# Altium project SR.PrjPcb (part 1 of 2)
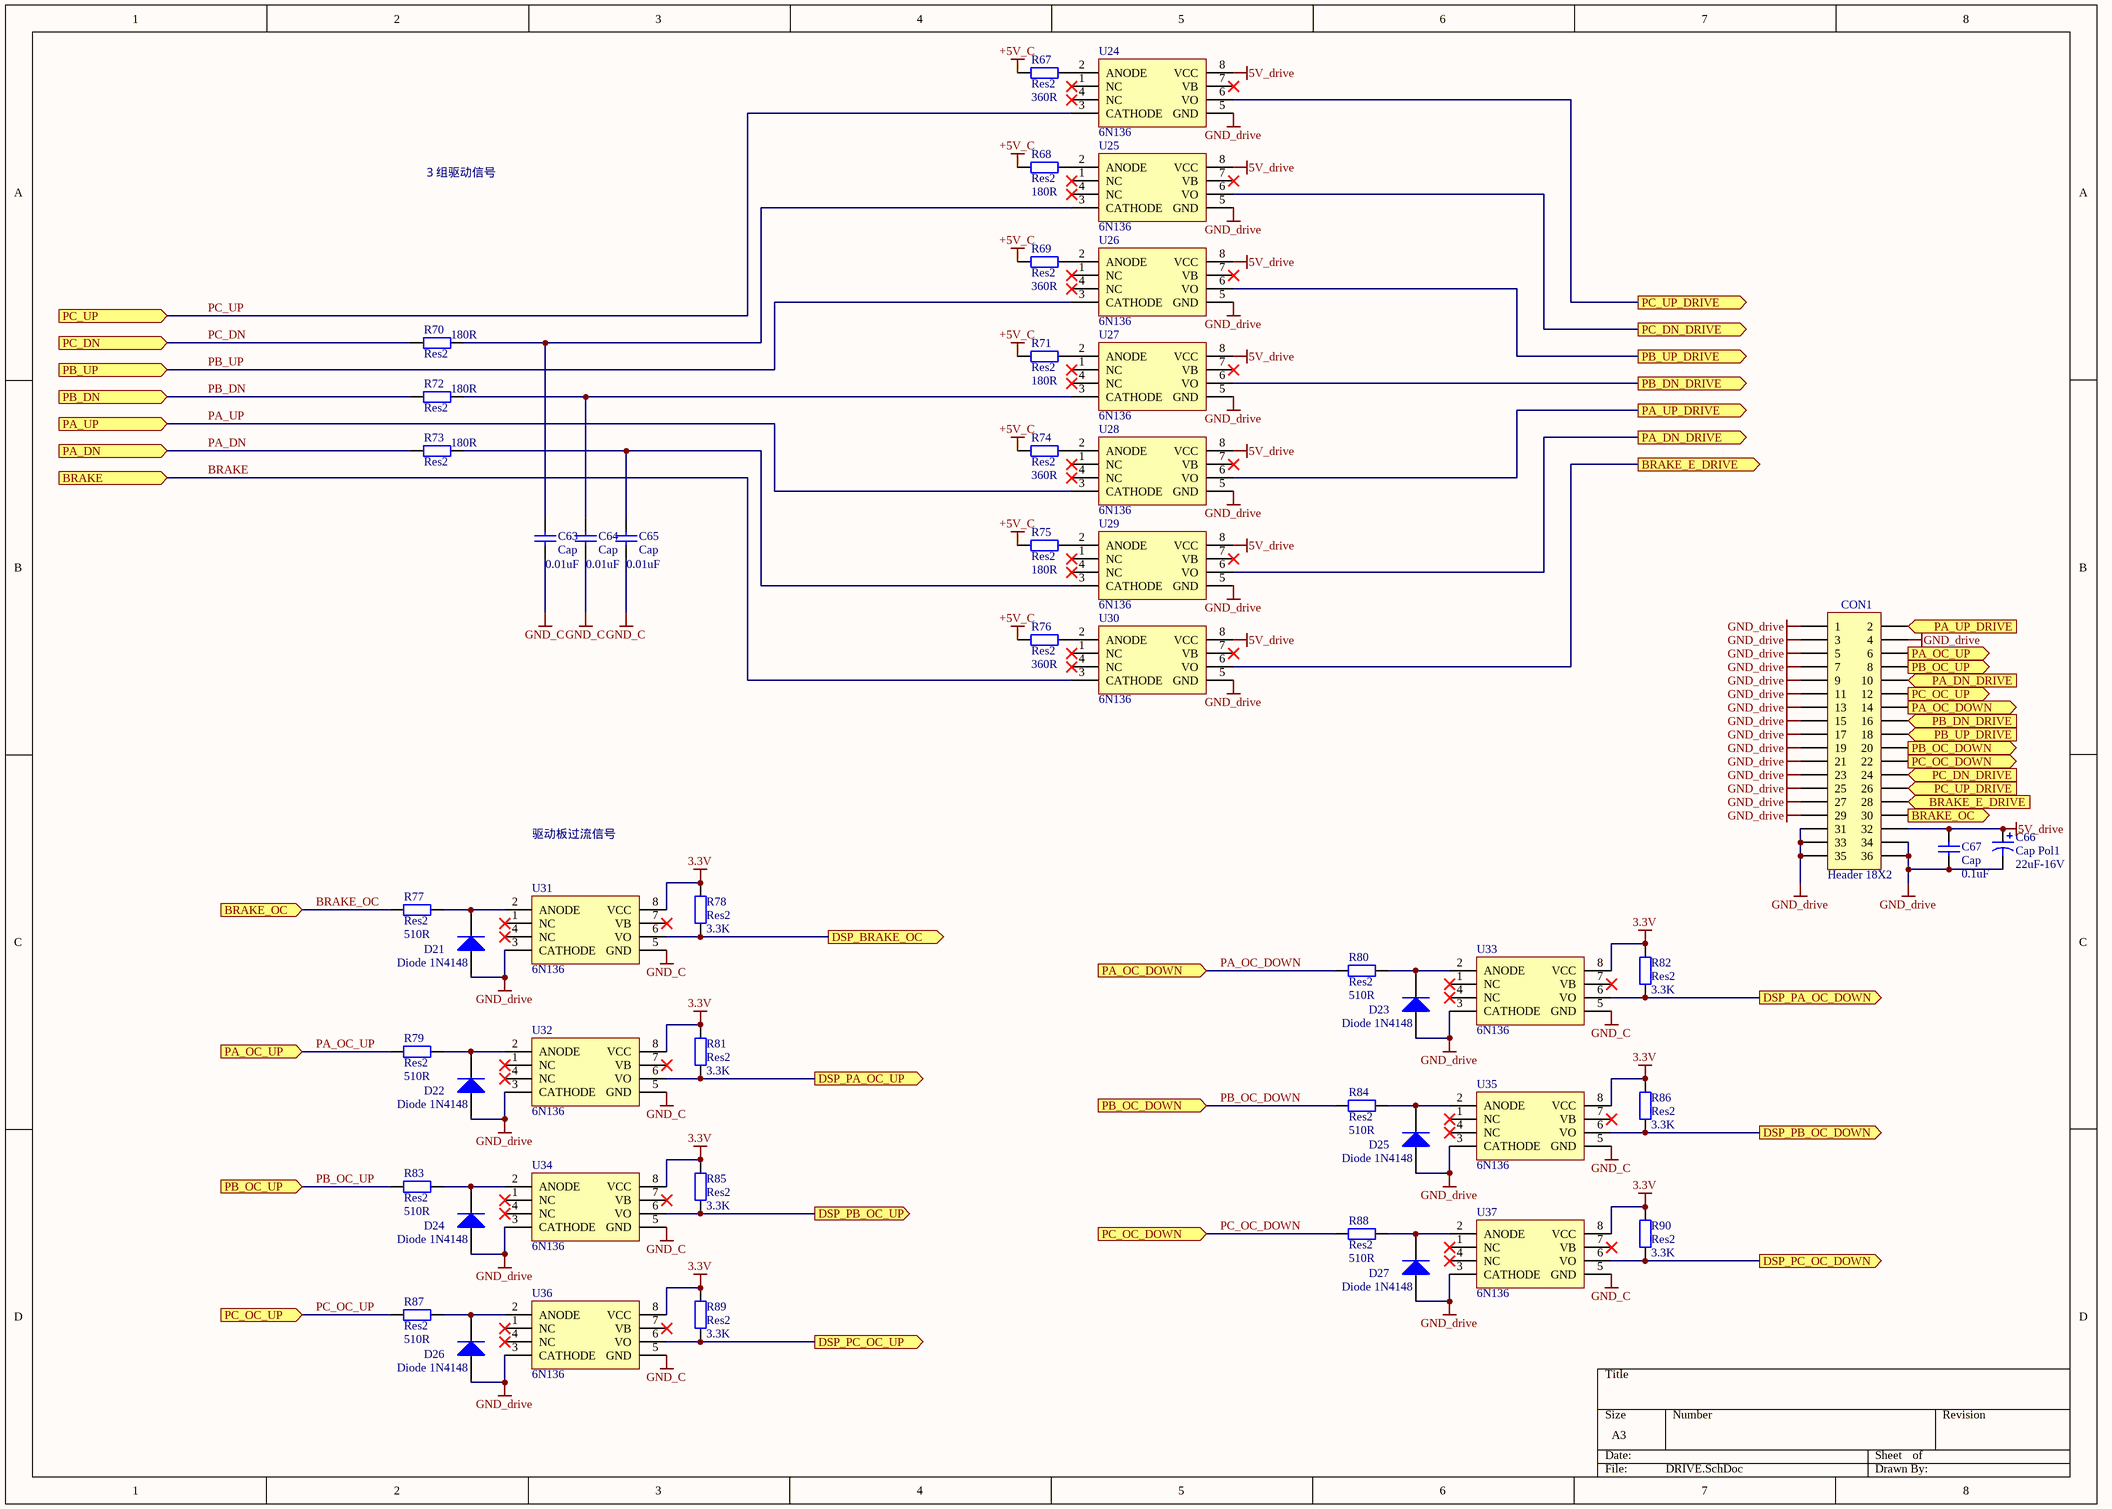
[diagram p0: DRIVE.SchDoc]
6 sheets, 393 parts. Net scope: global (net labels, ports and power ports of the same name join across sheets).
Board file: PCB2.PcbDoc
Sheets:
  DRIVE.SchDoc
  AIAO.SchDoc
  DIDO.SchDoc
  PERIPHERAL.SchDoc
  POWER.SchDoc
  dsp.SchDoc

## Sheet DRIVE.SchDoc
size A3

### Parts
C63  Cap  value 0.01uF  [1206]
C64  Cap  value 0.01uF  [1206]
C65  Cap  value 0.01uF  [1206]
C66  Cap Pol1  value 22uF-16V  [7343]
C67  Cap  value 0.1uF  [1206]
CON1  Header 18X2  [HDR2X18]
D21  Diode 1N4148  [SOD-80/MLL34]
D22  Diode 1N4148  [SOD-80/MLL34]
D23  Diode 1N4148  [SOD-80/MLL34]
D24  Diode 1N4148  [SOD-80/MLL34]
D25  Diode 1N4148  [SOD-80/MLL34]
D26  Diode 1N4148  [SOD-80/MLL34]
D27  Diode 1N4148  [SOD-80/MLL34]
R67  Res2  value 360R  [1206]
R68  Res2  value 180R  [1206]
R69  Res2  value 360R  [1206]
R70  Res2  value 180R  [1206]
R71  Res2  value 180R  [1206]
R72  Res2  value 180R  [1206]
R73  Res2  value 180R  [1206]
R74  Res2  value 360R  [1206]
R75  Res2  value 180R  [1206]
R76  Res2  value 360R  [1206]
R77  Res2  value 510R  [1206]
R78  Res2  value 3.3K  [1206]
R79  Res2  value 510R  [1206]
R80  Res2  value 510R  [1206]
R81  Res2  value 3.3K  [1206]
R82  Res2  value 3.3K  [1206]
R83  Res2  value 510R  [1206]
R84  Res2  value 510R  [1206]
R85  Res2  value 3.3K  [1206]
R86  Res2  value 3.3K  [1206]
R87  Res2  value 510R  [1206]
R88  Res2  value 510R  [1206]
R89  Res2  value 3.3K  [1206]
R90  Res2  value 3.3K  [1206]
U24  6N136  [DIP-8N]
U25  6N136  [DIP-8N]
U26  6N136  [DIP-8N]
U27  6N136  [DIP-8N]
U28  6N136  [DIP-8N]
U29  6N136  [DIP-8N]
U30  6N136  [DIP-8N]
U31  6N136  [DIP-8N]
U32  6N136  [DIP-8N]
U33  6N136  [DIP-8N]
U34  6N136  [DIP-8N]
U35  6N136  [DIP-8N]
U36  6N136  [DIP-8N]
U37  6N136  [DIP-8N]

### Ports
BRAKE (in), BRAKE_E_DRIVE (in), BRAKE_E_DRIVE (out), BRAKE_OC (in), BRAKE_OC (out), DSP_BRAKE_OC (out), DSP_PA_OC_DOWN (out), DSP_PA_OC_UP (out), DSP_PB_OC_DOWN (out), DSP_PB_OC_UP (out), DSP_PC_OC_DOWN (out), DSP_PC_OC_UP (out), PA_DN (in), PA_DN_DRIVE (in), PA_DN_DRIVE (out), PA_OC_DOWN (in), PA_OC_DOWN (out), PA_OC_UP (in), PA_OC_UP (out), PA_UP (in), PA_UP_DRIVE (in), PA_UP_DRIVE (out), PB_DN (in), PB_DN_DRIVE (in), PB_DN_DRIVE (out), PB_OC_DOWN (in), PB_OC_DOWN (out), PB_OC_UP (in), PB_OC_UP (out), PB_UP (in), PB_UP_DRIVE (in), PB_UP_DRIVE (out), PC_DN (in), PC_DN_DRIVE (in), PC_DN_DRIVE (out), PC_OC_DOWN (in), PC_OC_DOWN (out), PC_OC_UP (in), PC_OC_UP (out), PC_UP (in), PC_UP_DRIVE (in), PC_UP_DRIVE (out)

### Nets
3.3V: R78.2 R81.2 R82.2 R85.2 R86.2 R89.2 R90.2 U31.8(VCC) U32.8(VCC) U33.8(VCC) U34.8(VCC) U35.8(VCC) U36.8(VCC) U37.8(VCC)
5V_drive: C66.1 C67.2 CON1.32 U24.8(VCC) U25.8(VCC) U26.8(VCC) U27.8(VCC) U28.8(VCC) U29.8(VCC) U30.8(VCC)
+5V_C: R67.1 R68.1 R69.1 R71.1 R74.1 R75.1 R76.1
GND_C: C63.1 C64.1 C65.1 U31.5(GND) U32.5(GND) U33.5(GND) U34.5(GND) U35.5(GND) U36.5(GND) U37.5(GND)
GND_drive: C66.2 C67.1 CON1.1 CON1.3 CON1.4 CON1.5 CON1.7 CON1.9 CON1.11 CON1.13 CON1.15 CON1.17 CON1.19 CON1.21 CON1.23 CON1.25 CON1.27 CON1.29 CON1.31 CON1.33 CON1.34 CON1.35 CON1.36 D21.1(A) D22.1(A) D23.1(A) D24.1(A) D25.1(A) D26.1(A) D27.1(A) U24.5(GND) U25.5(GND) U26.5(GND) U27.5(GND) U28.5(GND) U29.5(GND) U30.5(GND) U31.3(CATHODE) U32.3(CATHODE) U33.3(CATHODE) U34.3(CATHODE) U35.3(CATHODE) U36.3(CATHODE) U37.3(CATHODE)
BRAKE: U30.3(CATHODE) ; port BRAKE
BRAKE_OC: CON1.30 R77.2 ; port BRAKE_OC
PA_DN: R73.1 ; port PA_DN
PA_OC_DOWN: CON1.14 R80.2 ; port PA_OC_DOWN
PA_OC_UP: CON1.6 R79.2 ; port PA_OC_UP
PA_UP: U28.3(CATHODE) ; port PA_UP
PB_DN: R72.1 ; port PB_DN
PB_OC_DOWN: CON1.20 R84.2 ; port PB_OC_DOWN
PB_OC_UP: CON1.8 R83.2 ; port PB_OC_UP
PB_UP: U26.3(CATHODE) ; port PB_UP
PC_DN: R70.1 ; port PC_DN
PC_OC_DOWN: CON1.22 R88.2 ; port PC_OC_DOWN
PC_OC_UP: CON1.12 R87.2 ; port PC_OC_UP
PC_UP: U24.3(CATHODE) ; port PC_UP
NetC63_2: C63.2 R70.2 U25.3(CATHODE)
NetC64_2: C64.2 R72.2 U27.3(CATHODE)
NetC65_2: C65.2 R73.2 U29.3(CATHODE)
NetCON1_2: CON1.2 U28.6(VO) ; port PA_UP_DRIVE
NetCON1_10: CON1.10 U29.6(VO) ; port PA_DN_DRIVE
NetCON1_16: CON1.16 U27.6(VO) ; port PB_DN_DRIVE
NetCON1_18: CON1.18 U26.6(VO) ; port PB_UP_DRIVE
NetCON1_24: CON1.24 U25.6(VO) ; port PC_DN_DRIVE
NetCON1_26: CON1.26 U24.6(VO) ; port PC_UP_DRIVE
NetCON1_28: CON1.28 U30.6(VO) ; port BRAKE_E_DRIVE
NetD21_2: D21.2(K) R77.1 U31.2(ANODE)
NetD22_2: D22.2(K) R79.1 U32.2(ANODE)
NetD23_2: D23.2(K) R80.1 U33.2(ANODE)
NetD24_2: D24.2(K) R83.1 U34.2(ANODE)
NetD25_2: D25.2(K) R84.1 U35.2(ANODE)
NetD26_2: D26.2(K) R87.1 U36.2(ANODE)
NetD27_2: D27.2(K) R88.1 U37.2(ANODE)
NetR67_2: R67.2 U24.2(ANODE)
NetR68_2: R68.2 U25.2(ANODE)
NetR69_2: R69.2 U26.2(ANODE)
NetR71_2: R71.2 U27.2(ANODE)
NetR74_2: R74.2 U28.2(ANODE)
NetR75_2: R75.2 U29.2(ANODE)
NetR76_2: R76.2 U30.2(ANODE)
NetR78_1: R78.1 U31.6(VO) ; port DSP_BRAKE_OC
NetR81_1: R81.1 U32.6(VO) ; port DSP_PA_OC_UP
NetR82_1: R82.1 U33.6(VO) ; port DSP_PA_OC_DOWN
NetR85_1: R85.1 U34.6(VO) ; port DSP_PB_OC_UP
NetR86_1: R86.1 U35.6(VO) ; port DSP_PB_OC_DOWN
NetR89_1: R89.1 U36.6(VO) ; port DSP_PC_OC_UP
NetR90_1: R90.1 U37.6(VO) ; port DSP_PC_OC_DOWN

Not connected (* = marked no-connect by the designer): U24 1(NC)* 4(NC)* 7(VB)*; U25 1(NC)* 4(NC)* 7(VB)*; U26 1(NC)* 4(NC)* 7(VB)*; U27 1(NC)* 4(NC)* 7(VB)*; U28 1(NC)* 4(NC)* 7(VB)*; U29 1(NC)* 4(NC)* 7(VB)*; U30 1(NC)* 4(NC)* 7(VB)*; U31 1(NC)* 4(NC)* 7(VB)*; U32 1(NC)* 4(NC)* 7(VB)*; U33 1(NC)* 4(NC)* 7(VB)*; U34 1(NC)* 4(NC)* 7(VB)*; U35 1(NC)* 4(NC)* 7(VB)*; U36 1(NC)* 4(NC)* 7(VB)*; U37 1(NC)* 4(NC)* 7(VB)*

### Notes on the sheet
- ３组驱动信号
- 驱动板过流信号

### Library data of the parts
C63-C65 C67 = Cap: Capacitor; Published: 8-Jun-2000; LatestRevisionDate: 17-Jul-2002; LatestRevisionNote: Re-released for DXP Platform.; PackageReference: RAD-0.3; Publisher: Altium Limited
C66 = Cap Pol1: Polarized Capacitor (Radial); Published: 8-Jun-2000; LatestRevisionDate: 17-Jul-2002; LatestRevisionNote: Re-released for DXP Platform.; PackageReference: RB7.6-15; Publisher: Altium Limited
CON1 = Header 18X2: Header, 18-Pin, Dual row; LatestRevisionDate: 17-Jul-2002; LatestRevisionNote: Re-released for DXP Platform.; Publisher: Altium Limited
D21-D27 = Diode 1N4148: High Conductance Fast Diode; Published: 8-Jun-2000; LatestRevisionDate: 17-Jul-2002; LatestRevisionNote: Re-released for DXP Platform.; DatasheetVersion: 1997; PackageReference: DO-35; Publisher: Altium Limited; Code_JEDEC: DO-204-AH; ComponentLink1Description: Manufacturer Link; ComponentLink1URL: http://www.fairchildsemi.com/; ComponentLink2Description: Datasheet; ComponentLink2URL: http://www.fairchildsemi.com/ds/1N%2F1N4148.pdf
R67-R90 = Res2: Resistor; Published: 8-Jun-2000; LatestRevisionDate: 17-Jul-2002; LatestRevisionNote: Re-released for DXP Platform.; PackageReference: AXIAL-0.4; Publisher: Altium Limited
U24-U37 = 6N136: 光耦

## Sheet AIAO.SchDoc
size A3
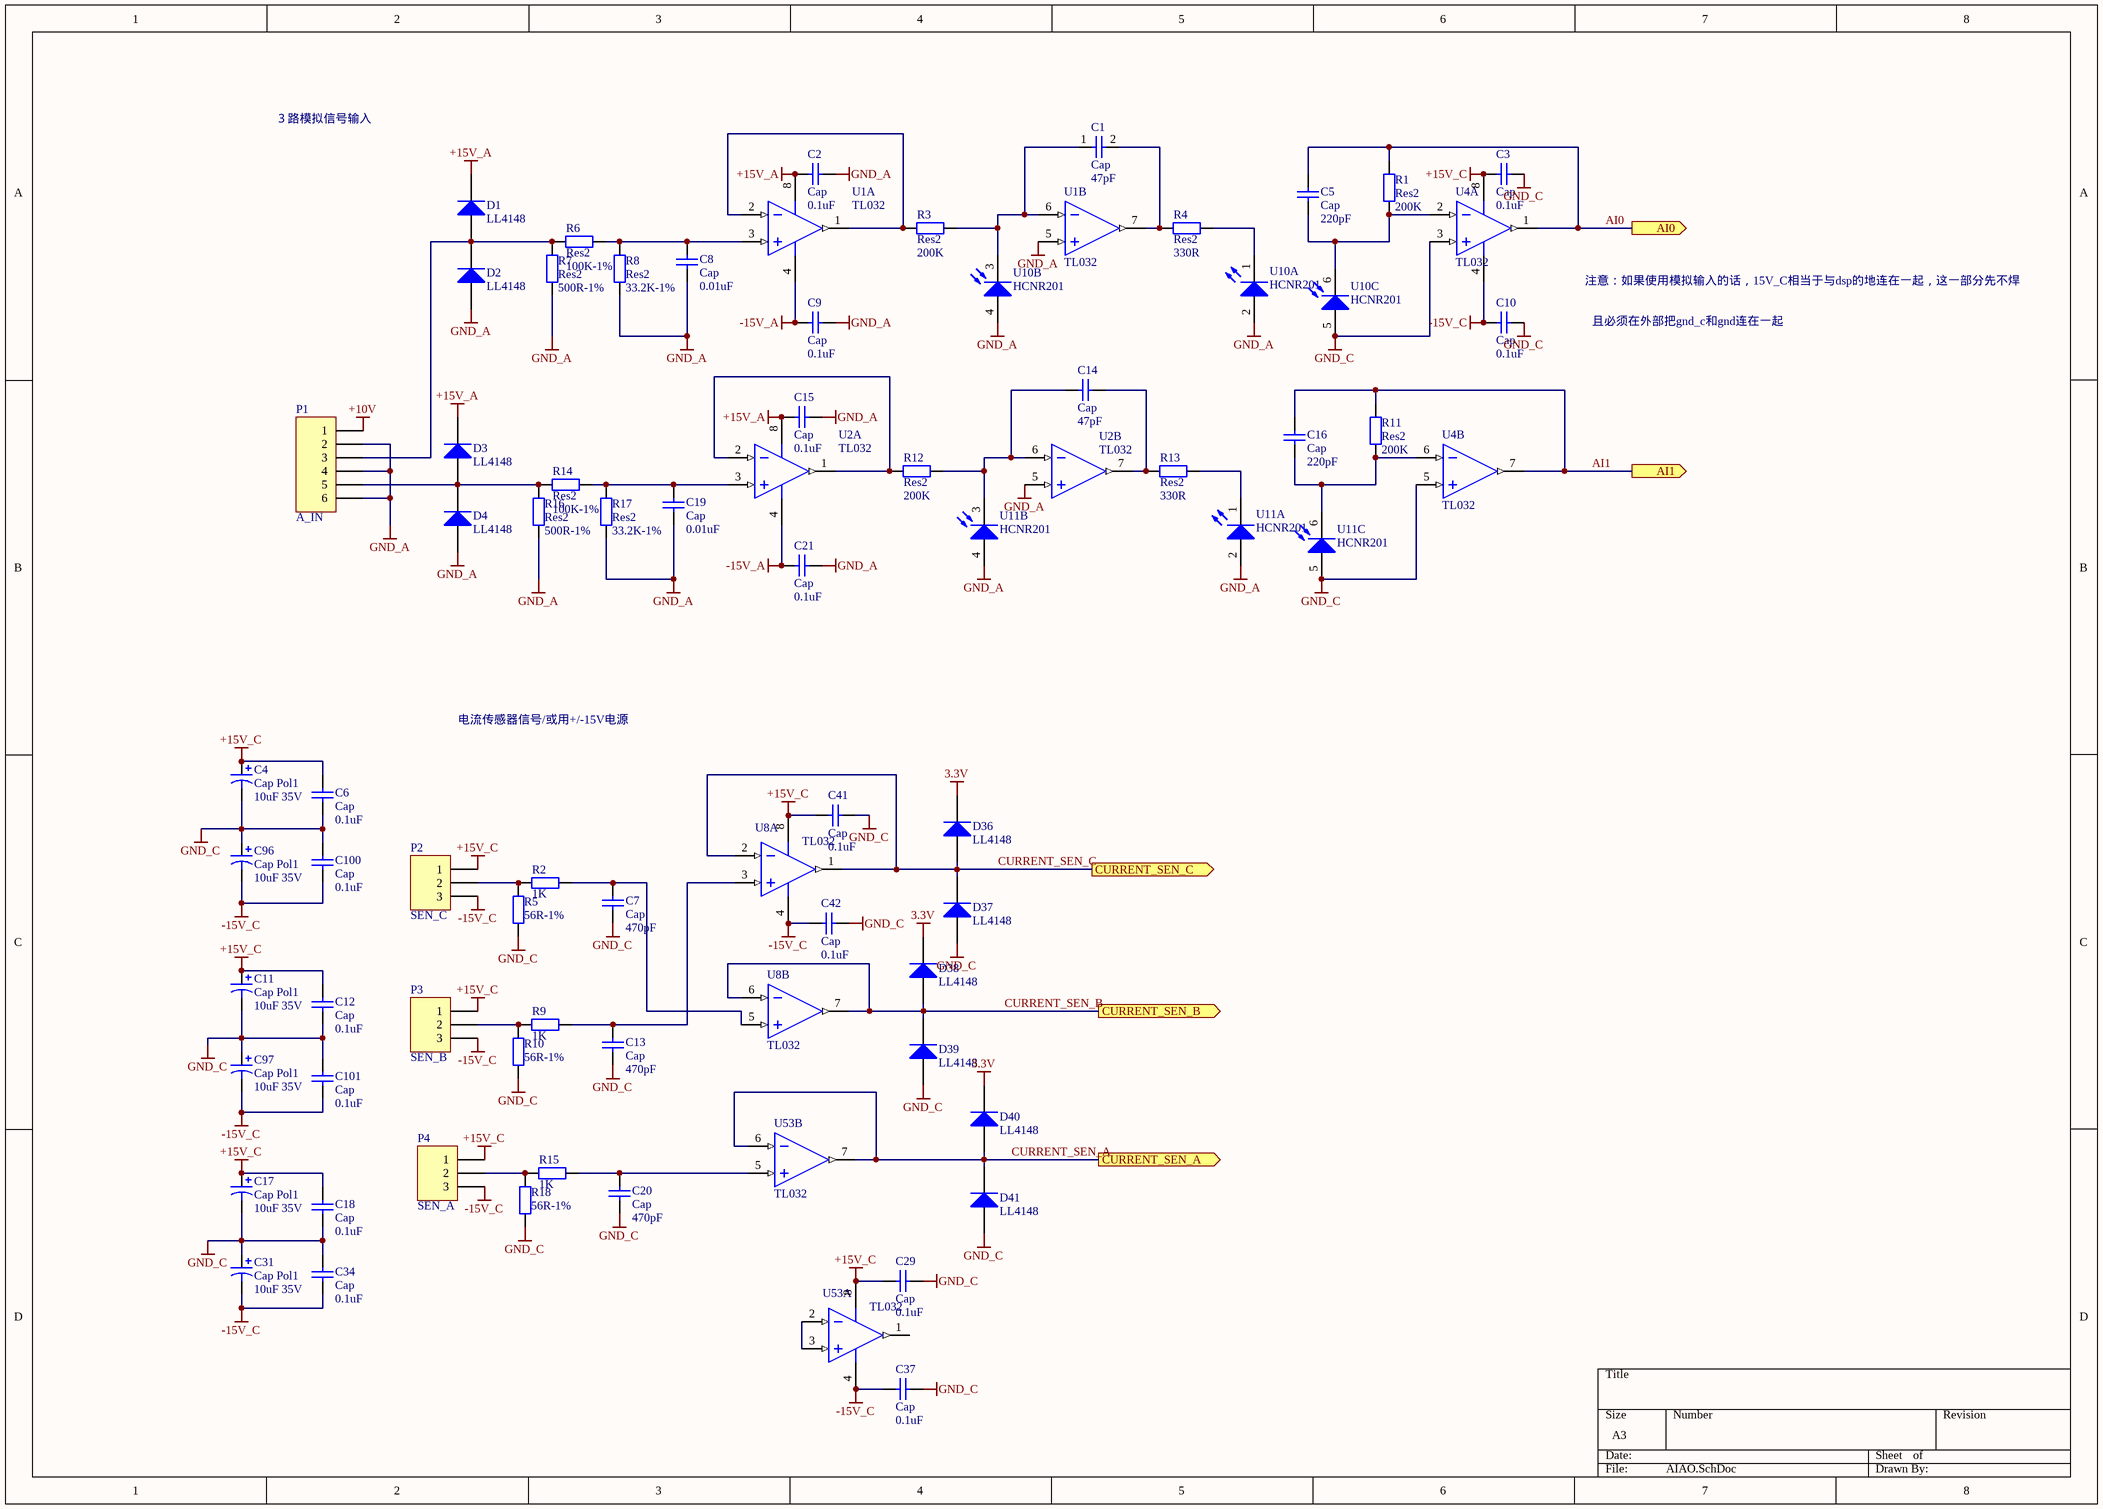
[diagram p1: AIAO.SchDoc]

### Parts
C1  Cap  value 47pF  [1206]
C2  Cap  value 0.1uF  [1206]
C3  Cap  value 0.1uF  [1206]
C4  Cap Pol1  value 10uF 35V  [1206]
C5  Cap  value 220pF  [1206]
C6  Cap  value 0.1uF  [1206]
C7  Cap  value 470pF  [1206]
C8  Cap  value 0.01uF  [1206]
C9  Cap  value 0.1uF  [1206]
C10  Cap  value 0.1uF  [1206]
C11  Cap Pol1  value 10uF 35V  [1206]
C12  Cap  value 0.1uF  [1206]
C13  Cap  value 470pF  [1206]
C14  Cap  value 47pF  [1206]
C15  Cap  value 0.1uF  [1206]
C16  Cap  value 220pF  [1206]
C17  Cap Pol1  value 10uF 35V  [1206]
C18  Cap  value 0.1uF  [1206]
C19  Cap  value 0.01uF  [1206]
C20  Cap  value 470pF  [1206]
C21  Cap  value 0.1uF  [1206]
C29  Cap  value 0.1uF  [1206]
C31  Cap Pol1  value 10uF 35V  [1206]
C34  Cap  value 0.1uF  [1206]
C37  Cap  value 0.1uF  [1206]
C41  Cap  value 0.1uF  [1206]
C42  Cap  value 0.1uF  [1206]
C96  Cap Pol1  value 10uF 35V  [1206]
C97  Cap Pol1  value 10uF 35V  [1206]
C100  Cap  value 0.1uF  [1206]
C101  Cap  value 0.1uF  [1206]
D1  LL4148  [SOD-80/MLL34]
D2  LL4148  [SOD-80/MLL34]
D3  LL4148  [SOD-80/MLL34]
D4  LL4148  [SOD-80/MLL34]
D36  LL4148  [SOD-80/MLL34]
D37  LL4148  [SOD-80/MLL34]
D38  LL4148  [SOD-80/MLL34]
D39  LL4148  [SOD-80/MLL34]
D40  LL4148  [SOD-80/MLL34]
D41  LL4148  [SOD-80/MLL34]
P1  A_IN  [phenox-6]
P2  SEN_C  [PHENOX-3]
P3  SEN_B  [PHENOX-3]
P4  SEN_A  [PHENOX-3]
R1  Res2  value 200K  [1206]
R2  value 1K  [1206]  (hidden comment: Res2)
R3  Res2  value 200K  [1206]
R4  Res2  value 330R  [1206]
R5  value 56R-1%  [1206]  (hidden comment: Res2)
R6  Res2  value 100K-1%  [1206]
R7  Res2  value 500R-1%  [1206]
R8  Res2  value 33.2K-1%  [1206]
R9  value 1K  [1206]  (hidden comment: Res2)
R10  value 56R-1%  [1206]  (hidden comment: Res2)
R11  Res2  value 200K  [1206]
R12  Res2  value 200K  [1206]
R13  Res2  value 330R  [1206]
R14  Res2  value 100K-1%  [1206]
R15  value 1K  [1206]  (hidden comment: Res2)
R16  Res2  value 500R-1%  [1206]
R17  Res2  value 33.2K-1%  [1206]
R18  value 56R-1%  [1206]  (hidden comment: Res2)
U1  TL032  [SO-8]  (parts A,B of 2)
U2  TL032  [SO-8]  (parts A,B of 2)
U4  TL032  [SO-8]  (parts A,B of 2)
U8  TL032  [SO-8]  (parts A,B of 2)
U10  HCNR201  [SOP254P1230X400-8N-2]  (parts A,B,C of 3)
U11  HCNR201  [SOP254P1230X400-8N-2]  (parts A,B,C of 3)
U53  TL032  [SO-8]  (parts A,B of 2)

### Ports
AI0 (out), AI1 (out), CURRENT_SEN_A (out), CURRENT_SEN_B (out), CURRENT_SEN_C (out)

### Nets
3.3V: D36.2(K) D38.2(K) D40.2(K)
+10V: P1.1
+15V_A: C2.1 C15.1 D1.2(K) D3.2(K) U1.8(V+) U2.8(V+)
+15V_C: C3.1 C4.1 C6.2 C11.1 C12.2 C17.1 C18.2 C29.2 C41.2 P2.1 P3.1 P4.1 U4.8(V+) U8.8(V+) U53.8(V+)
-15V_A: C9.1 C21.1 U1.4(V-) U2.4(V-)
-15V_C: C10.1 C31.2 C34.1 C37.2 C42.2 C96.2 C97.2 C100.1 C101.1 P2.3 P3.3 P4.3 U4.4(V-) U8.4(V-) U53.4(V-)
GND_A: C2.2 C8.1 C9.2 C15.2 C19.1 C21.2 D2.1(A) D4.1(A) P1.2 P1.4 P1.6 R7.1 R8.1 R16.1 R17.1 U1.5(IN+) U2.5(IN+) U10.2(A) U10.4(A) U11.2(A) U11.4(A)
GND_C: C3.2 C4.2 C6.1 C7.1 C10.2 C11.2 C12.1 C13.1 C17.2 C18.1 C20.1 C29.1 C31.1 C34.2 C37.1 C41.1 C42.1 C96.1 C97.1 C100.2 C101.2 D37.1(A) D39.1(A) D41.1(A) R5.1 R10.1 R18.1 U4.3(IN+) U4.5(IN+) U10.5(A) U11.5(A)
AI0: C5.2 R1.2 U4.1(OUT) ; port AI0
AI1: C16.2 R11.2 U4.7(OUT) ; port AI1
CURRENT_SEN_A: D40.1(A) D41.2(K) U53.6(IN-) U53.7(OUT) ; port CURRENT_SEN_A
CURRENT_SEN_B: D38.1(A) D39.2(K) U8.6(IN-) U8.7(OUT) ; port CURRENT_SEN_B
CURRENT_SEN_C: D36.1(A) D37.2(K) U8.1(OUT) U8.2(IN-) ; port CURRENT_SEN_C
NetC1_1: C1.1 R3.2 U1.6(IN-) U10.3(K)
NetC1_2: C1.2 R4.1 U1.7(OUT)
NetC5_1: C5.1 R1.1 U4.2(IN-) U10.6(K)
NetC7_2: C7.2 R2.2 U8.5(IN+)
NetC8_2: C8.2 R6.2 R8.2 U1.3(IN+)
NetC13_2: C13.2 R9.2 U8.3(IN+)
NetC14_1: C14.1 R12.2 U2.6(IN-) U11.3(K)
NetC14_2: C14.2 R13.1 U2.7(OUT)
NetC16_1: C16.1 R11.1 U4.6(IN-) U11.6(K)
NetC19_2: C19.2 R14.2 R17.2 U2.3(IN+)
NetC20_2: C20.2 R15.2 U53.5(IN+)
NetD1_1: D1.1(A) D2.2(K) P1.3 R6.1 R7.2
NetD3_1: D3.1(A) D4.2(K) P1.5 R14.1 R16.2
NetP2_2: P2.2 R2.1 R5.2
NetP3_2: P3.2 R9.1 R10.2
NetP4_2: P4.2 R15.1 R18.2
NetR3_1: R3.1 U1.1(OUT) U1.2(IN-)
NetR4_2: R4.2 U10.1(K)
NetR12_1: R12.1 U2.1(OUT) U2.2(IN-)
NetR13_2: R13.2 U11.1(K)
NetU53_2: U53.2(IN-) U53.3(IN+)

Not connected (* = marked no-connect by the designer): U53 1(OUT)

### Notes on the sheet
- ３路模拟信号输入
- 注意：如果使用模拟输入的话，15V_C相当于与dsp的地连在一起，这一部分先不焊
- 且必须在外部把gnd_c和gnd连在一起
- 电流传感器信号/或用+/-15V电源

### Library data of the parts
C1-C3 C5-C10 C12-C16 C18-C21 C29 C34 C37 C41 C42 C100 C101 = Cap: Capacitor; Published: 8-Jun-2000; LatestRevisionDate: 17-Jul-2002; LatestRevisionNote: Re-released for DXP Platform.; PackageReference: RAD-0.3; Publisher: Altium Limited
C4 C11 C17 C31 C96 C97 = Cap Pol1: Polarized Capacitor (Radial); Published: 8-Jun-2000; LatestRevisionDate: 17-Jul-2002; LatestRevisionNote: Re-released for DXP Platform.; PackageReference: RB7.6-15; Publisher: Altium Limited
D1-D4 = Diode 1N4148: High Conductance Fast Diode; Published: 8-Jun-2000; LatestRevisionDate: 17-Jul-2002; LatestRevisionNote: Re-released for DXP Platform.; DatasheetVersion: 1997; PackageReference: DO-35; Publisher: Altium Limited; Code_JEDEC: DO-204-AH; ComponentLink1Description: Manufacturer Link; ComponentLink1URL: http://www.fairchildsemi.com/; ComponentLink2Description: Datasheet; ComponentLink2URL: http://www.fairchildsemi.com/ds/1N%2F1N4148.pdf
D36-D41 = Diode 1N4007: 1 Amp General Purpose Rectifier; Published: 8-Jun-2000; LatestRevisionDate: 17-Jul-2002; LatestRevisionNote: Re-released for DXP Platform.; DatasheetVersion: 1998; PackageVersion: Aug-1999; PackageReference: DO-41; Publisher: Altium Limited; Code_JEDEC: DO-204-AL; ComponentLink1Description: Manufacturer Link; ComponentLink1URL: http://www.fairchildsemi.com/; ComponentLink2Description: Datasheet; ComponentLink2URL: http://www.fairchildsemi.com/ds/1N%2F1N4001.pdf
P1 = Header 6: Header, 6-Pin; LatestRevisionDate: 17-Jul-2002; LatestRevisionNote: Re-released for DXP Platform.; Publisher: Altium Limited
P2-P4 = Header 3: Header, 3-Pin; LatestRevisionDate: 17-Jul-2002; LatestRevisionNote: Re-released for DXP Platform.; Publisher: Altium Limited
R1-R18 = Res2: Resistor; Published: 8-Jun-2000; LatestRevisionDate: 17-Jul-2002; LatestRevisionNote: Re-released for DXP Platform.; PackageReference: AXIAL-0.4; Publisher: Altium Limited

## Sheet DIDO.SchDoc
size A3
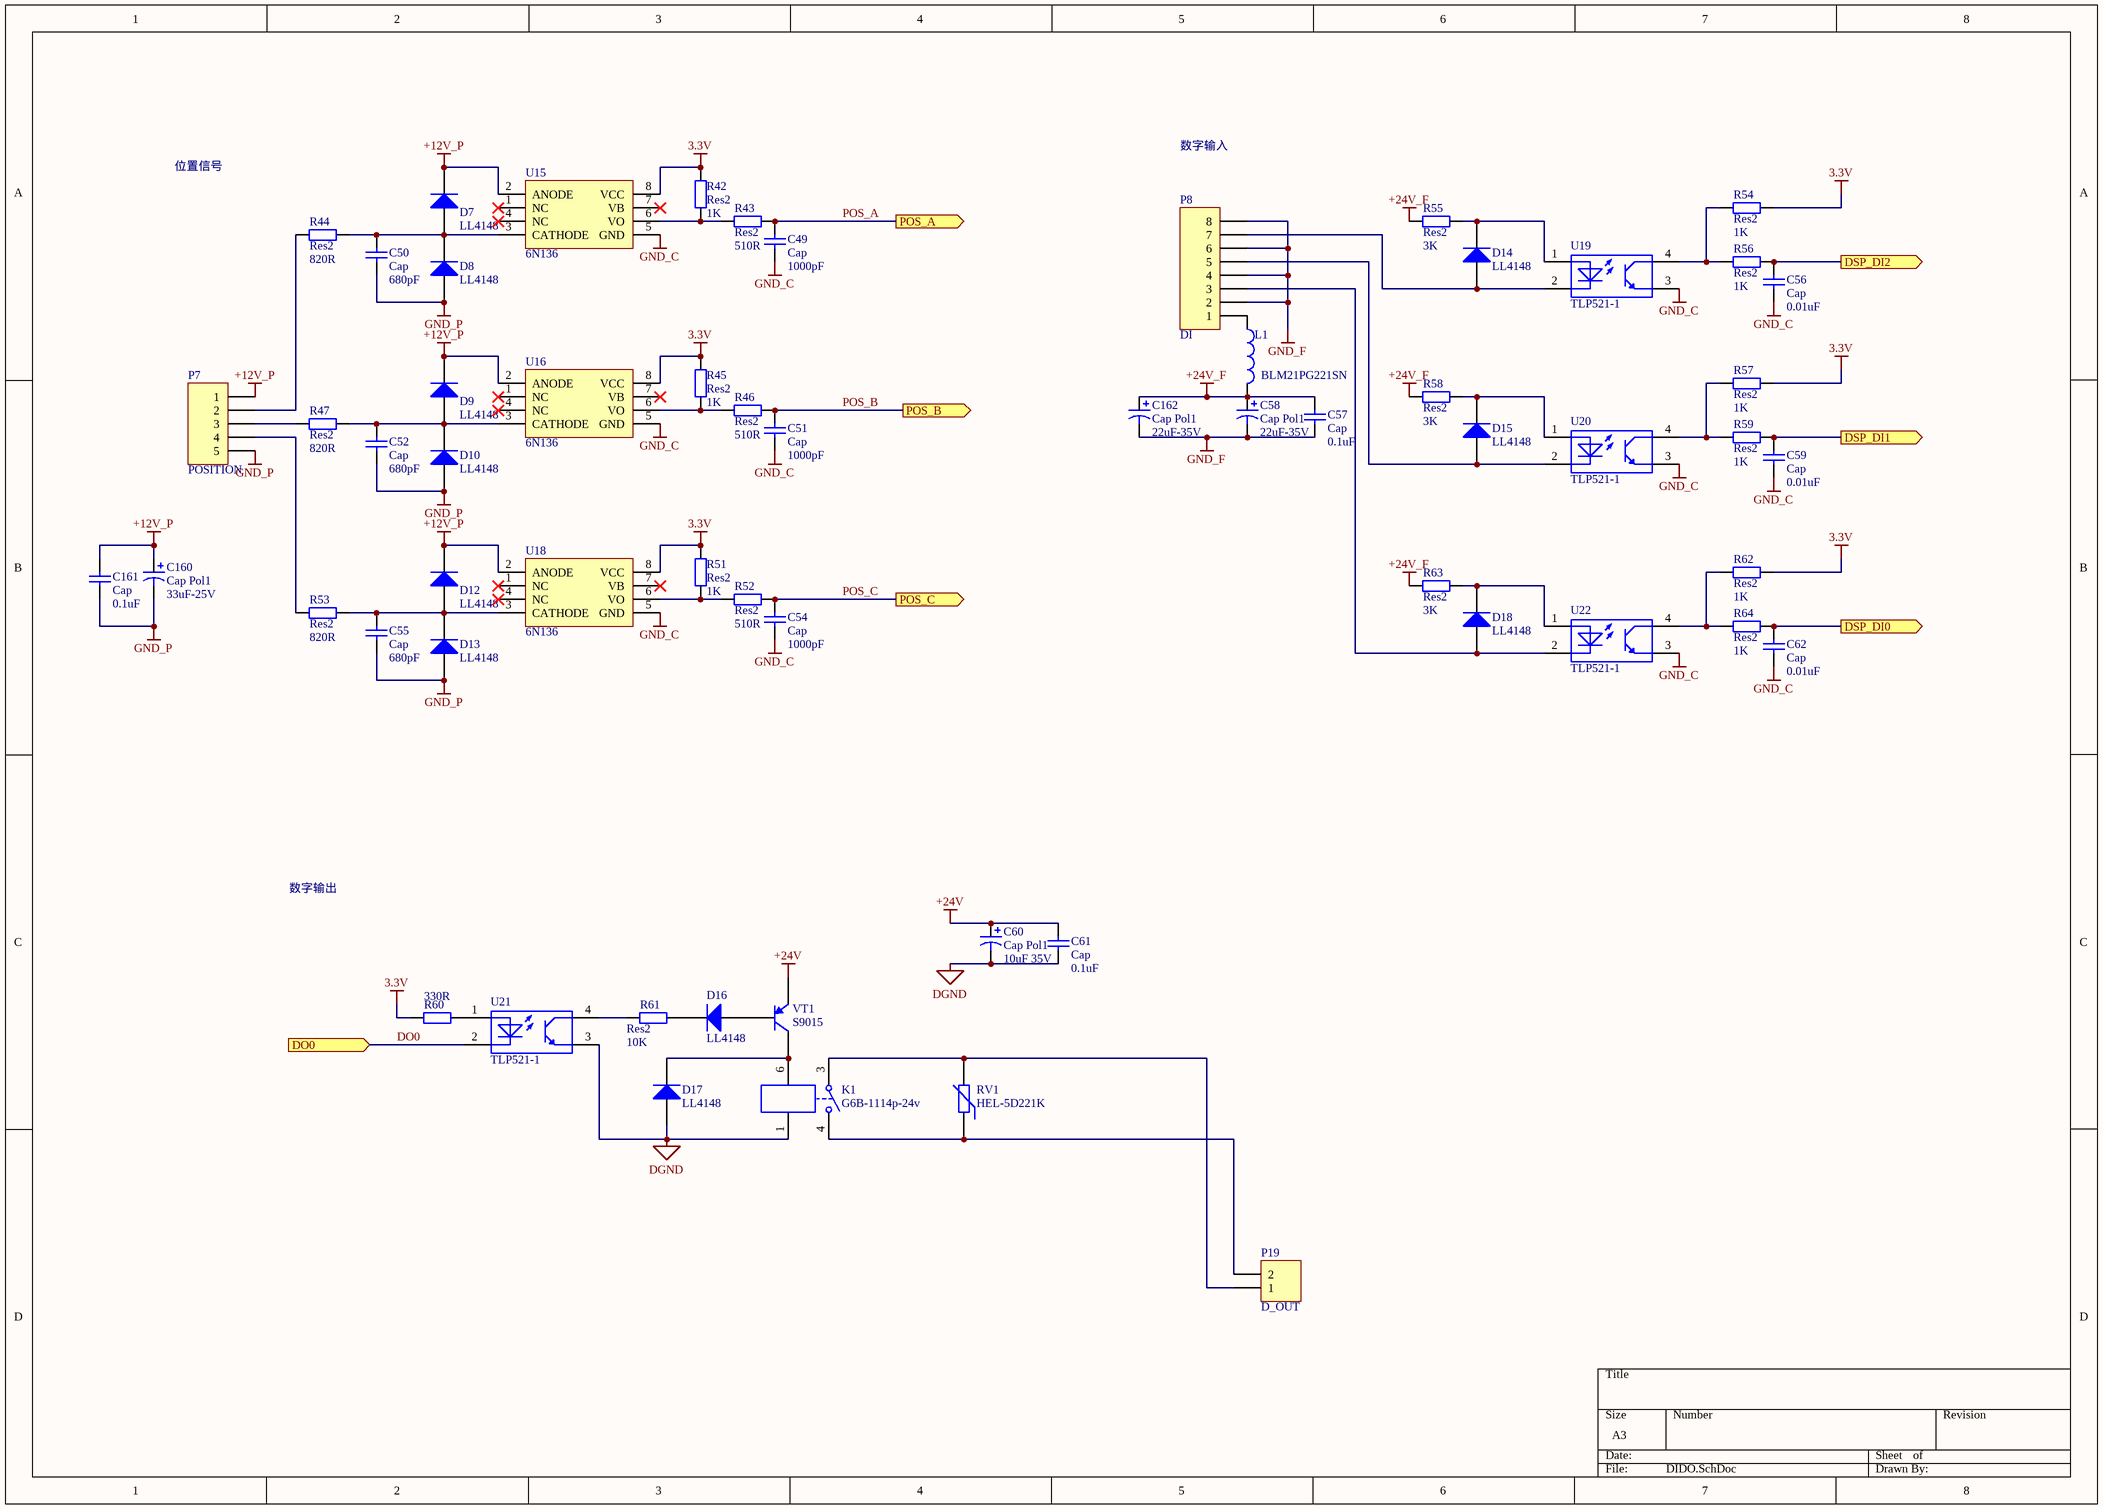
[diagram p2: DIDO.SchDoc]

### Parts
C49  Cap  value 1000pF  [1206]
C50  Cap  value 680pF  [1206]
C51  Cap  value 1000pF  [1206]
C52  Cap  value 680pF  [1206]
C54  Cap  value 1000pF  [1206]
C55  Cap  value 680pF  [1206]
C56  Cap  value 0.01uF  [1206]
C57  Cap  value 0.1uF  [1206]
C58  Cap Pol1  value 22uF-35V  [7343]
C59  Cap  value 0.01uF  [1206]
C60  Cap Pol1  value 10uF 35V  [7343]
C61  Cap  value 0.1uF  [1206]
C62  Cap  value 0.01uF  [1206]
C160  Cap Pol1  value 33uF-25V  [7343]
C161  Cap  value 0.1uF  [1206]
C162  Cap Pol1  value 22uF-35V  [7343]
D7  LL4148  [SOD-80/MLL34]
D8  LL4148  [SOD-80/MLL34]
D9  LL4148  [SOD-80/MLL34]
D10  LL4148  [SOD-80/MLL34]
D12  LL4148  [SOD-80/MLL34]
D13  LL4148  [SOD-80/MLL34]
D14  LL4148  [SOD-80/MLL34]
D15  LL4148  [SOD-80/MLL34]
D16  LL4148  [SOD-80/MLL34]
D17  LL4148  [SOD-80/MLL34]
D18  LL4148  [SOD-80/MLL34]
K1  G6B-1114p-24v  [SPST-NO]
L1  BLM21PG221SN  [2012]
P7  POSITION  [phenox-5]
P8  DI  [phenox-8]
P19  D_OUT  [phenox-2]
R42  Res2  value 1K  [1206]
R43  Res2  value 510R  [1206]
R44  Res2  value 820R  [1206]
R45  Res2  value 1K  [1206]
R46  Res2  value 510R  [1206]
R47  Res2  value 820R  [1206]
R51  Res2  value 1K  [1206]
R52  Res2  value 510R  [1206]
R53  Res2  value 820R  [1206]
R54  Res2  value 1K  [1206]
R55  Res2  value 3K  [1206]
R56  Res2  value 1K  [1206]
R57  Res2  value 1K  [1206]
R58  Res2  value 3K  [1206]
R59  Res2  value 1K  [1206]
R60  value 330R  [1206]  (hidden comment: Res2)
R61  Res2  value 10K  [1206]
R62  Res2  value 1K  [1206]
R63  Res2  value 3K  [1206]
R64  Res2  value 1K  [1206]
RV1  HEL-5D221K  [RAD-0.2]
U15  6N136  [DIP-8N]
U16  6N136  [DIP-8N]
U18  6N136  [DIP-8N]
U19  TLP521-1  [DIP4]
U20  TLP521-1  [DIP4]
U21  TLP521-1  [DIP4]
U22  TLP521-1  [DIP4]
VT1  S9015  [SOT23]

### Ports
DO0 (in), DSP_DI0 (out), DSP_DI1 (out), DSP_DI2 (out), POS_A (out), POS_B (out), POS_C (out)

### Nets
3.3V: R42.2 R45.2 R51.2 R54.2 R57.2 R60.1 R62.2 U15.8(VCC) U16.8(VCC) U18.8(VCC)
+12V_P: C160.1 C161.2 D7.2(K) D9.2(K) D12.2(K) P7.1 U15.2(ANODE) U16.2(ANODE) U18.2(ANODE)
+24V: C60.1 C61.2 VT1.3
+24V_F: C57.2 C58.1 C162.1 L1.2 R55.1 R58.1 R63.1
DGND: C60.2 C61.1 D17.1(A) K1.1 U21.3
GND_C: C49.1 C51.1 C54.1 C56.1 C59.1 C62.1 U15.5(GND) U16.5(GND) U18.5(GND) U19.3 U20.3 U22.3
GND_F: C57.1 C58.2 C162.2 P8.2 P8.4 P8.6 P8.8
GND_P: C50.1 C52.1 C55.1 C160.2 C161.1 D8.1(A) D10.1(A) D13.1(A) P7.5
DO0: U21.2 ; port DO0
POS_A: C49.2 R43.2 ; port POS_A
POS_B: C51.2 R46.2 ; port POS_B
POS_C: C54.2 R52.2 ; port POS_C
NetC50_2: C50.2 D7.1(A) D8.2(K) R44.2 U15.3(CATHODE)
NetC52_2: C52.2 D9.1(A) D10.2(K) R47.2 U16.3(CATHODE)
NetC55_2: C55.2 D12.1(A) D13.2(K) R53.2 U18.3(CATHODE)
NetC56_2: C56.2 R56.2 ; port DSP_DI2
NetC59_2: C59.2 R59.2 ; port DSP_DI1
NetC62_2: C62.2 R64.2 ; port DSP_DI0
NetD14_1: D14.1(A) P8.7 U19.2
NetD14_2: D14.2(K) R55.2 U19.1
NetD15_1: D15.1(A) P8.5 U20.2
NetD15_2: D15.2(K) R58.2 U20.1
NetD16_1: D16.1(A) VT1.2
NetD16_2: D16.2(K) R61.2
NetD17_2: D17.2(K) K1.6 VT1.1
NetD18_1: D18.1(A) P8.3 U22.2
NetD18_2: D18.2(K) R63.2 U22.1
NetK1_3: K1.3 P19.1 RV1.2
NetK1_4: K1.4 P19.2 RV1.1
NetL1_1: L1.1 P8.1
NetP7_2: P7.2 R44.1
NetP7_3: P7.3 R47.1
NetP7_4: P7.4 R53.1
NetR42_1: R42.1 R43.1 U15.6(VO)
NetR45_1: R45.1 R46.1 U16.6(VO)
NetR51_1: R51.1 R52.1 U18.6(VO)
NetR54_1: R54.1 R56.1 U19.4
NetR57_1: R57.1 R59.1 U20.4
NetR60_2: R60.2 U21.1
NetR61_1: R61.1 U21.4
NetR62_1: R62.1 R64.1 U22.4

Not connected (* = marked no-connect by the designer): U15 1(NC)* 4(NC)* 7(VB)*; U16 1(NC)* 4(NC)* 7(VB)*; U18 1(NC)* 4(NC)* 7(VB)*

### Notes on the sheet
- 位置信号
- 数字输入
- 数字输出

### Library data of the parts
C49-C52 C54-C57 C59 C61 C62 C161 = Cap: Capacitor; Published: 8-Jun-2000; LatestRevisionDate: 17-Jul-2002; LatestRevisionNote: Re-released for DXP Platform.; PackageReference: RAD-0.3; Publisher: Altium Limited
C58 C60 C160 C162 = Cap Pol1: Polarized Capacitor (Radial); Published: 8-Jun-2000; LatestRevisionDate: 17-Jul-2002; LatestRevisionNote: Re-released for DXP Platform.; PackageReference: RB7.6-15; Publisher: Altium Limited
D7-D10 D12 D13 D16 = Diode 1N4148: High Conductance Fast Diode; Published: 8-Jun-2000; LatestRevisionDate: 17-Jul-2002; LatestRevisionNote: Re-released for DXP Platform.; DatasheetVersion: 1997; PackageReference: DO-35; Publisher: Altium Limited; Code_JEDEC: DO-204-AH; ComponentLink1Description: Manufacturer Link; ComponentLink1URL: http://www.fairchildsemi.com/; ComponentLink2Description: Datasheet; ComponentLink2URL: http://www.fairchildsemi.com/ds/1N%2F1N4148.pdf
D14 D15 D17 D18 = Diode 1N4007: 1 Amp General Purpose Rectifier; Published: 8-Jun-2000; LatestRevisionDate: 17-Jul-2002; LatestRevisionNote: Re-released for DXP Platform.; DatasheetVersion: 1998; PackageVersion: Aug-1999; PackageReference: DO-41; Publisher: Altium Limited; Code_JEDEC: DO-204-AL; ComponentLink1Description: Manufacturer Link; ComponentLink1URL: http://www.fairchildsemi.com/; ComponentLink2Description: Datasheet; ComponentLink2URL: http://www.fairchildsemi.com/ds/1N%2F1N4001.pdf
K1 = Relay-SPST: Single-Pole Single-Throw Relay; Published: 24-Mar-1999; LatestRevisionDate: 17-Jul-2002; LatestRevisionNote: Re-released for DXP Platform.; PackageReference: MODULE4; Publisher: Altium Limited
L1 = Inductor: Code_IEC: 1005; Value: 10mH; Published: 8-Jun-2000; LatestRevisionDate: 29-May-2009; LatestRevisionNote: IPC-7351 Footprint Added.; PackageReference: 0402-A; Publisher: Altium Limited; PackageDescription: Chip Inductor; Code_JEITA: 0402
P7 = Header 5: Header, 5-Pin; LatestRevisionDate: 17-Jul-2002; LatestRevisionNote: Re-released for DXP Platform.; Publisher: Altium Limited
P8 = Header 8: Header, 8-Pin; LatestRevisionDate: 17-Jul-2002; LatestRevisionNote: Re-released for DXP Platform.; Publisher: Altium Limited
P19 = Header 2: Header, 2-Pin; LatestRevisionDate: 17-Jul-2002; LatestRevisionNote: Re-released for DXP Platform.; Publisher: Altium Limited
R42-R47 R51-R64 = Res2: Resistor; Published: 8-Jun-2000; LatestRevisionDate: 17-Jul-2002; LatestRevisionNote: Re-released for DXP Platform.; PackageReference: AXIAL-0.4; Publisher: Altium Limited
U15 U16 U18 = 6N136: 光耦

## Sheet PERIPHERAL.SchDoc
size A3
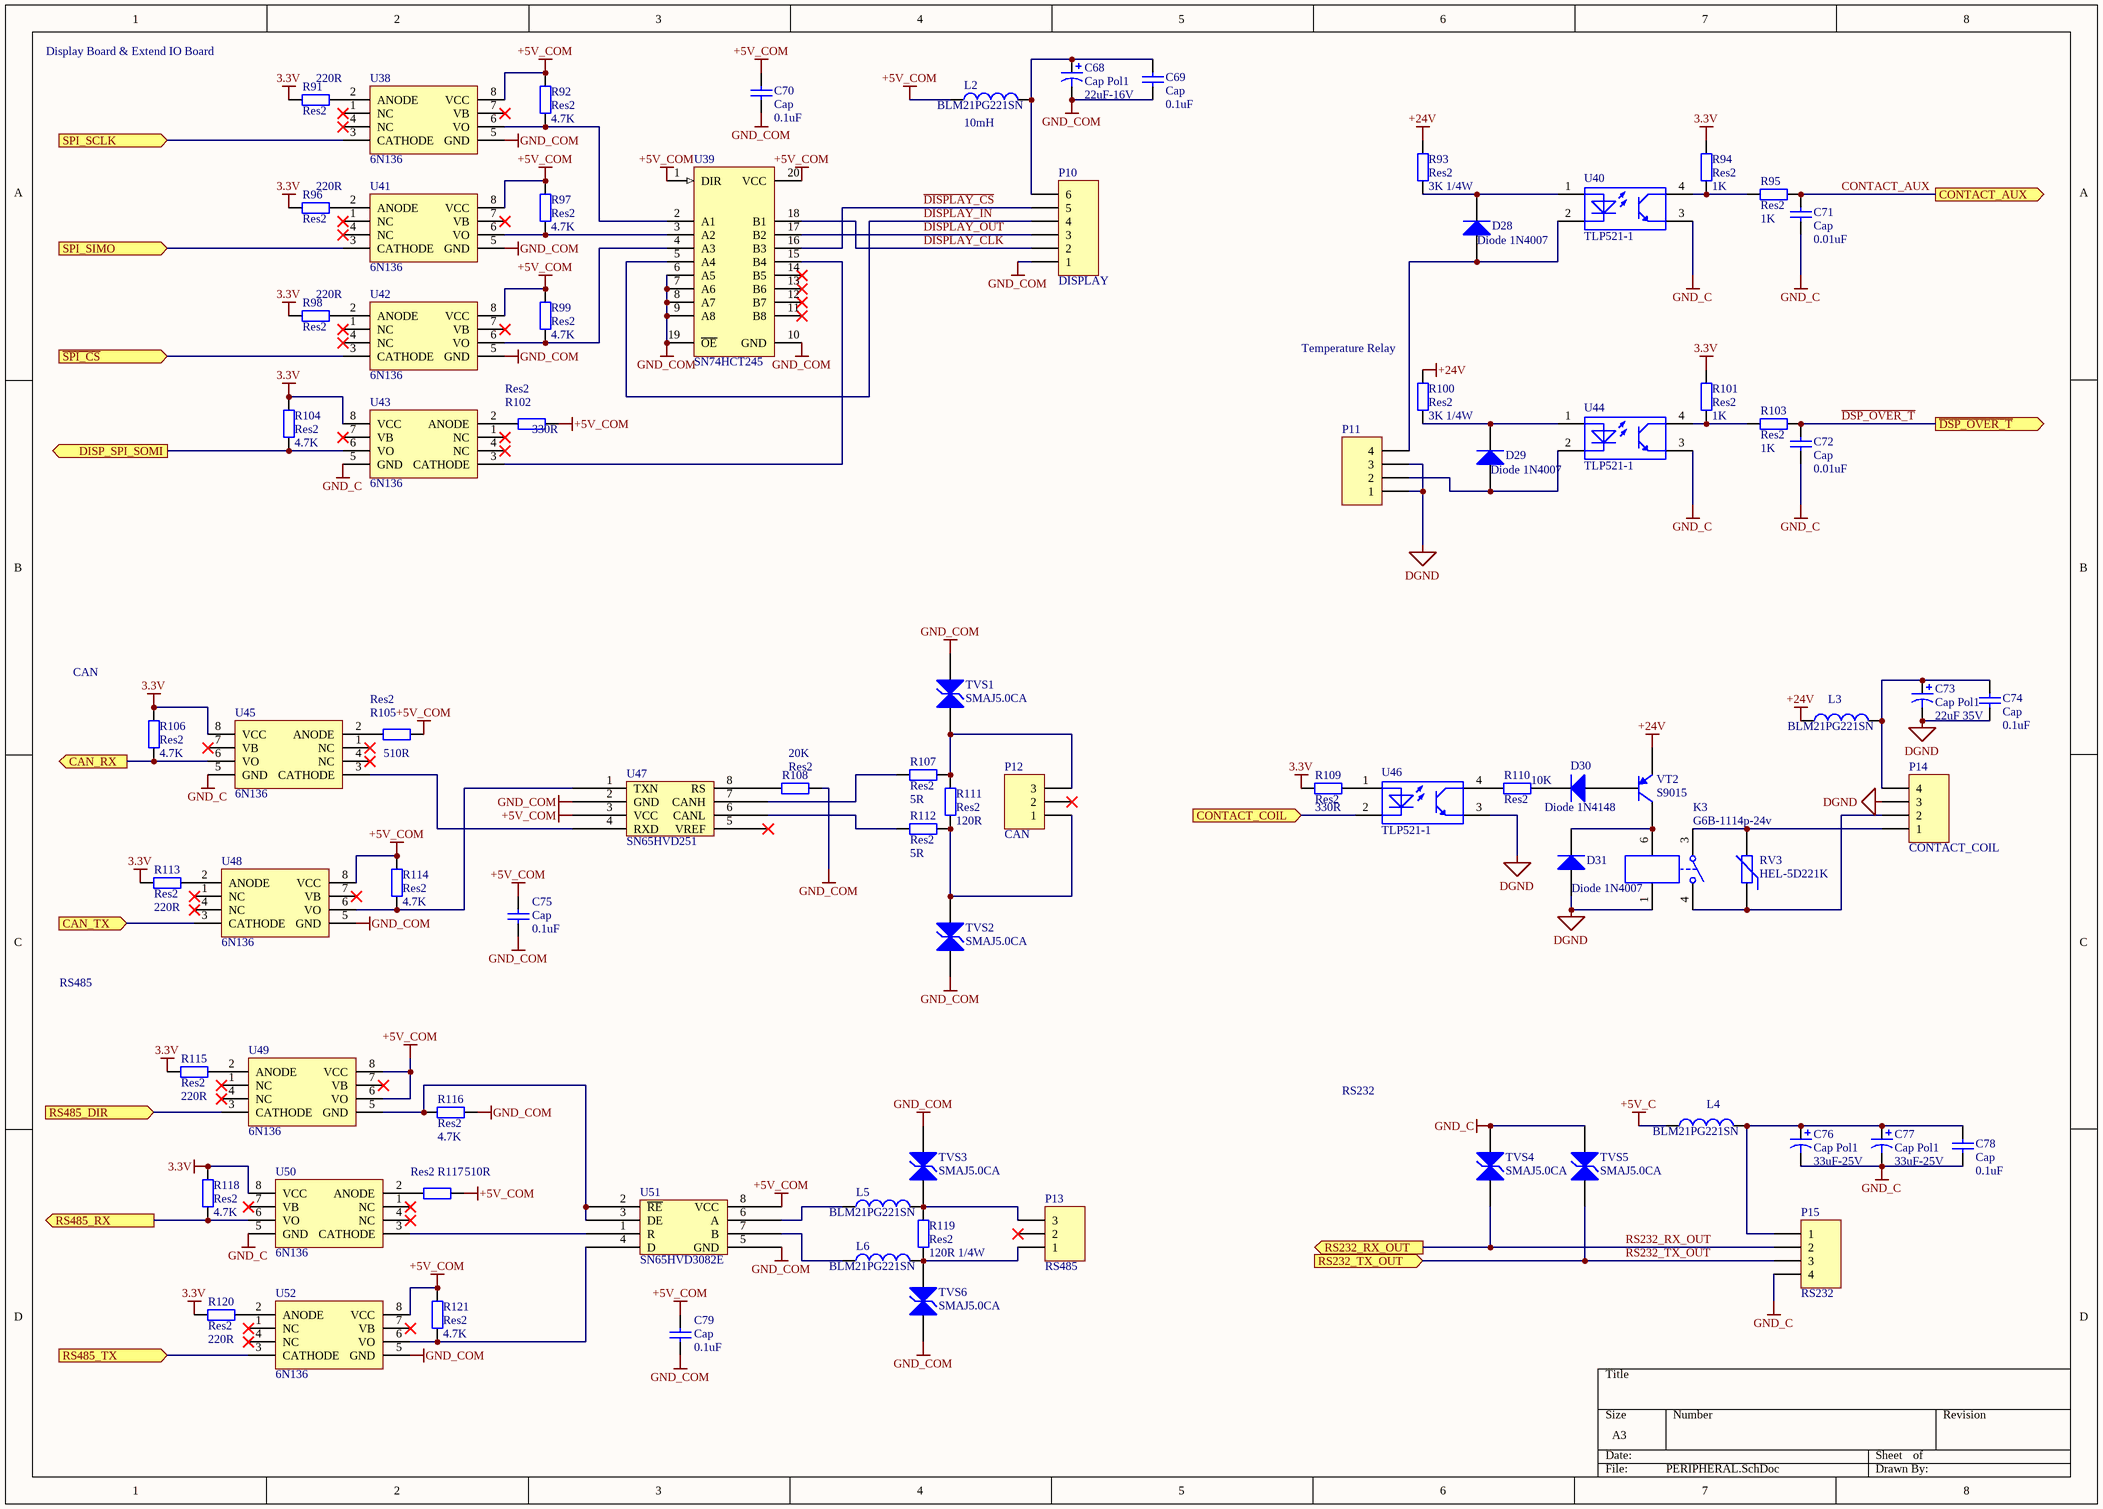
[diagram p3: PERIPHERAL.SchDoc]

### Parts
C68  Cap Pol1  value 22uF-16V  [7343]
C69  Cap  value 0.1uF  [1206]
C70  Cap  value 0.1uF  [1206]
C71  Cap  value 0.01uF  [1206]
C72  Cap  value 0.01uF  [1206]
C73  Cap Pol1  value 22uF 35V  [7343]
C74  Cap  value 0.1uF  [1206]
C75  Cap  value 0.1uF  [1206]
C76  Cap Pol1  value 33uF-25V  [7343]
C77  Cap Pol1  value 33uF-25V  [7343]
C78  Cap  value 0.1uF  [1206]
C79  Cap  value 0.1uF  [1206]
D28  Diode 1N4007  [SMA]
D29  Diode 1N4007  [SMA]
D30  Diode 1N4148  [SOD-80/MLL34]
D31  Diode 1N4007  [SMA]
K3  G6B-1114p-24v  [SPST-NO]
L2  BLM21PG221SN  value 10mH  [2012]
L3  BLM21PG221SN  [2012]
L4  BLM21PG221SN  [2012]
L5  BLM21PG221SN  [2012]
L6  BLM21PG221SN  [2012]
P10  DISPLAY  [phenox-6]
P11  TR  [PHONEX-4]  (value not drawn)
P12  CAN  [PHENOX-3]
P13  RS485  [PHENOX-3]
P14  CONTACT_COIL  [PHONEX-4]
P15  RS232  [PHONEX-4]
R91  Res2  value 220R  [1206]
R92  Res2  value 4.7K  [1206]
R93  Res2  value 3K 1/4W  [1206]
R94  Res2  value 1K  [1206]
R95  Res2  value 1K  [1206]
R96  Res2  value 220R  [1206]
R97  Res2  value 4.7K  [1206]
R98  Res2  value 220R  [1206]
R99  Res2  value 4.7K  [1206]
R100  Res2  value 3K 1/4W  [1206]
R101  Res2  value 1K  [1206]
R102  Res2  value 330R  [1206]
R103  Res2  value 1K  [1206]
R104  Res2  value 4.7K  [1206]
R105  Res2  value 510R  [1206]
R106  Res2  value 4.7K  [1206]
R107  Res2  value 5R  [1206]
R108  Res2  value 20K  [1206]
R109  Res2  value 330R  [1206]
R110  Res2  value 10K  [1206]
R111  Res2  value 120R  [1206]
R112  Res2  value 5R  [1206]
R113  Res2  value 220R  [1206]
R114  Res2  value 4.7K  [1206]
R115  Res2  value 220R  [1206]
R116  Res2  value 4.7K  [1206]
R117  Res2  value 510R  [1206]
R118  Res2  value 4.7K  [1206]
R119  Res2  value 120R 1/4W  [1206]
R120  Res2  value 220R  [1206]
R121  Res2  value 4.7K  [1206]
RV3  HEL-5D221K  [RAD-0.2]
TVS1  SMAJ5.0CA  [TVS-SMA]
TVS2  SMAJ5.0CA  [TVS-SMA]
TVS3  SMAJ5.0CA  [TVS-SMA]
TVS4  SMAJ5.0CA  [TVS-SMA]
TVS5  SMAJ5.0CA  [TVS-SMA]
TVS6  SMAJ5.0CA  [TVS-SMA]
U38  6N136  [DIP-8N]
U39  SN74HCT245  [SO20_M]
U40  TLP521-1  [DIP4]
U41  6N136  [DIP-8N]
U42  6N136  [DIP-8N]
U43  6N136  [DIP-8N]
U44  TLP521-1  [DIP4]
U45  6N136  [DIP-8N]
U46  TLP521-1  [DIP4]
U47  SN65HVD251  [SO-8]
U48  6N136  [DIP-8N]
U49  6N136  [DIP-8N]
U50  6N136  [DIP-8N]
U51  SN65HVD3082E  [SO-8]
U52  6N136  [DIP-8N]
VT2  S9015  [SOT23]

### Ports
CAN_RX (out), CAN_TX (in), CONTACT_AUX (out), CONTACT_COIL (in), DISP_SPI_SOMI (out), RS232_RX_OUT (out), RS232_TX_OUT (in), RS485_DIR (in), RS485_RX (out), RS485_TX (in), SPI_SCLK (in), SPI_SIMO (in), ~{DSP_OVER_T} (out), ~{SPI_CS} (in)

### Nets
3.3V: R91.1 R94.2 R96.1 R98.1 R101.2 R104.2 R106.2 R109.1 R113.1 R115.1 R118.2 R120.1 U43.8(VCC) U45.8(VCC) U50.8(VCC)
+5V_C: L4.1
+5V_COM: C70.2 C75.2 C79.2 L2.1 R92.2 R97.2 R99.2 R102.1 R105.1 R114.2 R117.1 R121.2 U38.8(VCC) U39.1(DIR) U39.20(VCC) U41.8(VCC) U42.8(VCC) U47.3(VCC) U48.8(VCC) U49.6(VO) U49.8(VCC) U51.8(VCC) U52.8(VCC)
+24V: L3.1 R93.2 R100.2 VT2.3(E)
DGND: C73.2 C74.1 D31.1(A) K3.1 P11.1 P11.3 P14.3 U46.3
GND_C: C71.1 C72.1 C76.2 C77.2 C78.1 P15.4 TVS4.2(K) TVS5.2(K) U40.3 U43.5(GND) U44.3 U45.5(GND) U50.5(GND)
GND_COM: C68.2 C69.1 C70.1 C75.1 C79.1 P10.1 R108.2 R116.2 TVS1.2(K) TVS2.1(A) TVS3.1(A) TVS6.2(K) U38.5(GND) U39.6(A5) U39.7(A6) U39.8(A7) U39.9(A8) U39.10(GND) U39.19(~{OE}) U41.5(GND) U42.5(GND) U47.2(GND) U48.5(GND) U51.5(GND) U52.5(GND)
CONTACT_AUX: C71.2 R95.1 ; port CONTACT_AUX
~{DISPLAY_CS}: P10.5 U39.16(B3)
~{DSP_OVER_T}: C72.2 R103.1 ; port ~{DSP_OVER_T}
DISPLAY_CLK: P10.2 U39.18(B1)
DISPLAY_IN: P10.4 U39.5(A4)
DISPLAY_OUT: P10.3 U39.17(B2)
RS232_RX_OUT: P15.2 TVS4.1(A) ; port RS232_RX_OUT
RS232_TX_OUT: P15.3 TVS5.1(A) ; port RS232_TX_OUT
NetC68_1: C68.1 C69.2 L2.2 P10.6
NetC73_1: C73.1 C74.2 L3.2 P14.4
NetC76_1: C76.1 C77.1 C78.2 L4.2 P15.1
NetD28_1: D28.1(A) P11.4 U40.2
NetD28_2: D28.2(K) R93.1 U40.1
NetD29_1: D29.1(A) P11.2 U44.2
NetD29_2: D29.2(K) R100.1 U44.1
NetD30_1: D30.1(A) VT2.2(B)
NetD30_2: D30.2(K) R110.2
NetD31_2: D31.2(K) K3.6 VT2.1(C)
NetK3_3: K3.3 P14.1 RV3.2
NetK3_4: K3.4 P14.2 RV3.1
NetL5_1: L5.1 U51.6(A)
NetL5_2: L5.2 P13.3 R119.2 TVS3.2(K)
NetL6_1: L6.1 U51.7(B)
NetL6_2: L6.2 P13.1 R119.1 TVS6.1(A)
NetP12_1: P12.1 R111.1 R112.2 TVS2.2(K)
NetP12_3: P12.3 R107.2 R111.2 TVS1.1(A)
NetR91_2: R91.2 U38.2(ANODE)
NetR92_1: R92.1 U38.6(VO) U39.2(A1)
NetR94_1: R94.1 R95.2 U40.4
NetR96_2: R96.2 U41.2(ANODE)
NetR97_1: R97.1 U39.3(A2) U41.6(VO)
NetR98_2: R98.2 U42.2(ANODE)
NetR99_1: R99.1 U39.4(A3) U42.6(VO)
NetR101_1: R101.1 R103.2 U44.4
NetR102_2: R102.2 U43.2(ANODE)
NetR104_1: R104.1 U43.6(VO) ; port DISP_SPI_SOMI
NetR105_2: R105.2 U45.2(ANODE)
NetR106_1: R106.1 U45.6(VO) ; port CAN_RX
NetR107_1: R107.1 U47.7(CANH)
NetR108_1: R108.1 U47.8(RS)
NetR109_2: R109.2 U46.1
NetR110_1: R110.1 U46.4
NetR112_1: R112.1 U47.6(CANL)
NetR113_2: R113.2 U48.2(ANODE)
NetR114_1: R114.1 U47.1(TXN) U48.6(VO)
NetR115_2: R115.2 U49.2(ANODE)
NetR116_1: R116.1 U49.5(GND) U51.2(~{RE}) U51.3(DE)
NetR117_2: R117.2 U50.2(ANODE)
NetR118_1: R118.1 U50.6(VO) ; port RS485_RX
NetR120_2: R120.2 U52.2(ANODE)
NetR121_1: R121.1 U51.4(D) U52.6(VO)
NetU38_3: U38.3(CATHODE) ; port SPI_SCLK
NetU39_15: U39.15(B4) U43.3(CATHODE)
NetU41_3: U41.3(CATHODE) ; port SPI_SIMO
NetU42_3: U42.3(CATHODE) ; port ~{SPI_CS}
NetU45_3: U45.3(CATHODE) U47.4(RXD)
NetU46_2: U46.2 ; port CONTACT_COIL
NetU48_3: U48.3(CATHODE) ; port CAN_TX
NetU49_3: U49.3(CATHODE) ; port RS485_DIR
NetU50_3: U50.3(CATHODE) U51.1(R)
NetU52_3: U52.3(CATHODE) ; port RS485_TX

Not connected (* = marked no-connect by the designer): P12 2*; P13 2*; U38 1(NC)* 4(NC)* 7(VB)*; U39 11(B8)* 12(B7)* 13(B6)* 14(B5)*; U41 1(NC)* 4(NC)* 7(VB)*; U42 1(NC)* 4(NC)* 7(VB)*; U43 1(NC)* 4(NC)* 7(VB)*; U45 1(NC)* 4(NC)* 7(VB)*; U47 5(VREF)*; U48 1(NC)* 4(NC)* 7(VB)*; U49 1(NC)* 4(NC)* 7(VB)*; U50 1(NC)* 4(NC)* 7(VB)*; U52 1(NC)* 4(NC)* 7(VB)*

### Notes on the sheet
- Display Board & Extend IO Board
- (near R100) Temperature Relay
- CAN
- RS485
- RS232

### Library data of the parts
C68 C73 C76 C77 = Cap Pol1: Polarized Capacitor (Radial); Published: 8-Jun-2000; LatestRevisionDate: 17-Jul-2002; LatestRevisionNote: Re-released for DXP Platform.; PackageReference: RB7.6-15; Publisher: Altium Limited
C69-C72 C74 C75 C78 C79 = Cap: Capacitor; Published: 8-Jun-2000; LatestRevisionDate: 17-Jul-2002; LatestRevisionNote: Re-released for DXP Platform.; PackageReference: RAD-0.3; Publisher: Altium Limited
D28 D29 D31 = Diode 1N4007: 1 Amp General Purpose Rectifier; Published: 8-Jun-2000; LatestRevisionDate: 17-Jul-2002; LatestRevisionNote: Re-released for DXP Platform.; DatasheetVersion: 1998; PackageVersion: Aug-1999; PackageReference: DO-41; Publisher: Altium Limited; Code_JEDEC: DO-204-AL; ComponentLink1Description: Manufacturer Link; ComponentLink1URL: http://www.fairchildsemi.com/; ComponentLink2Description: Datasheet; ComponentLink2URL: http://www.fairchildsemi.com/ds/1N%2F1N4001.pdf
D30 = Diode 1N4148: High Conductance Fast Diode; Published: 8-Jun-2000; LatestRevisionDate: 17-Jul-2002; LatestRevisionNote: Re-released for DXP Platform.; DatasheetVersion: 1997; PackageReference: DO-35; Publisher: Altium Limited; Code_JEDEC: DO-204-AH; ComponentLink1Description: Manufacturer Link; ComponentLink1URL: http://www.fairchildsemi.com/; ComponentLink2Description: Datasheet; ComponentLink2URL: http://www.fairchildsemi.com/ds/1N%2F1N4148.pdf
K3 = Relay-SPST: Single-Pole Single-Throw Relay; Published: 24-Mar-1999; LatestRevisionDate: 17-Jul-2002; LatestRevisionNote: Re-released for DXP Platform.; PackageReference: MODULE4; Publisher: Altium Limited
L2 = Inductor: Code_IEC: 1005; Published: 8-Jun-2000; LatestRevisionDate: 29-May-2009; LatestRevisionNote: IPC-7351 Footprint Added.; PackageReference: 0402-A; Publisher: Altium Limited; PackageDescription: Chip Inductor; Code_JEITA: 0402
L4-L6 = Inductor: Code_IEC: 1005; Value: 10mH; Published: 8-Jun-2000; LatestRevisionDate: 29-May-2009; LatestRevisionNote: IPC-7351 Footprint Added.; PackageReference: 0402-A; Publisher: Altium Limited; PackageDescription: Chip Inductor; Code_JEITA: 0402
P10 = Header 6: Header, 6-Pin; LatestRevisionDate: 17-Jul-2002; LatestRevisionNote: Re-released for DXP Platform.; Publisher: Altium Limited
P11 P14 P15 = Header 4: Header, 4-Pin; LatestRevisionDate: 17-Jul-2002; LatestRevisionNote: Re-released for DXP Platform.; Publisher: Altium Limited
P12 P13 = Header 3: Header, 3-Pin; LatestRevisionDate: 17-Jul-2002; LatestRevisionNote: Re-released for DXP Platform.; Publisher: Altium Limited
R91-R121 = Res2: Resistor; Published: 8-Jun-2000; LatestRevisionDate: 17-Jul-2002; LatestRevisionNote: Re-released for DXP Platform.; PackageReference: AXIAL-0.4; Publisher: Altium Limited
U38 U41-U43 U45 U48-U50 U52 = 6N136: 光耦

## Sheet POWER.SchDoc
size A3
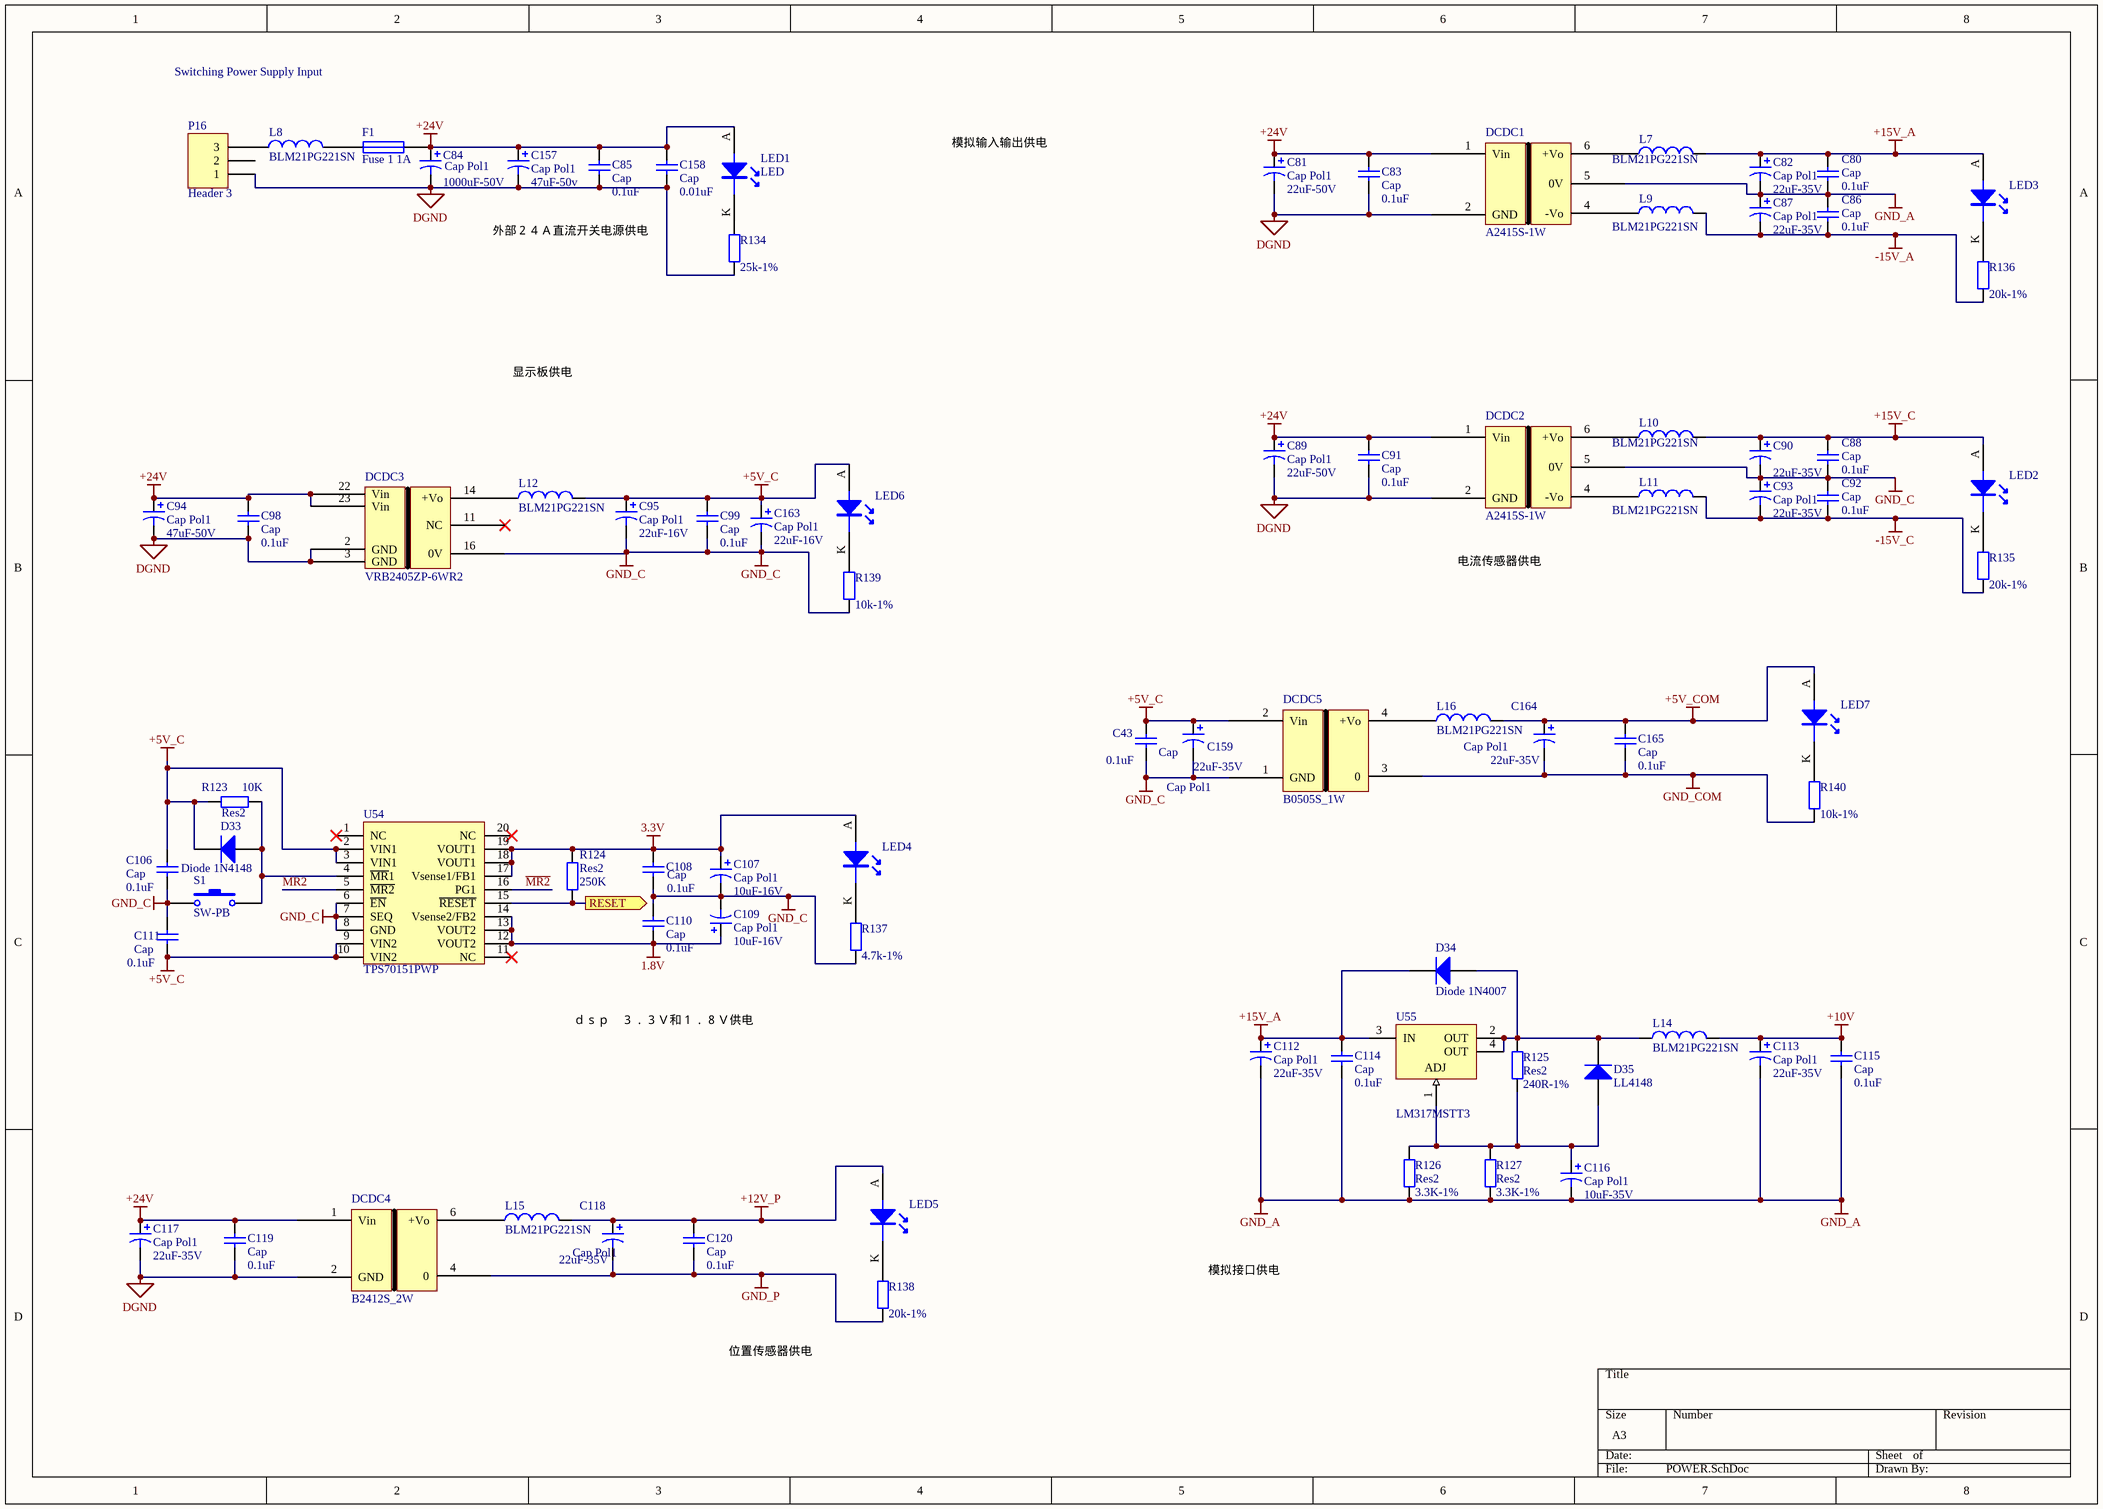
[diagram p4: POWER.SchDoc]

### Parts
C43  Cap  value 0.1uF  [1206]
C80  Cap  value 0.1uF  [1206]
C81  Cap Pol1  value 22uF-50V  [7343]
C82  Cap Pol1  value 22uF-35V  [7343]
C83  Cap  value 0.1uF  [1206]
C84  Cap Pol1  value 1000uF-50V  [电解电容1000uF]
C85  Cap  value 0.1uF  [1206]
C86  Cap  value 0.1uF  [1206]
C87  Cap Pol1  value 22uF-35V  [7343]
C88  Cap  value 0.1uF  [1206]
C89  Cap Pol1  value 22uF-50V  [7343]
C90  value 22uF-35V  [7343]  (hidden comment: Cap Pol1)
C91  Cap  value 0.1uF  [1206]
C92  Cap  value 0.1uF  [1206]
C93  Cap Pol1  value 22uF-35V  [7343]
C94  Cap Pol1  value 47uF-50V  [电解电容47uf]
C95  Cap Pol1  value 22uF-16V  [7343]
C98  Cap  value 0.1uF  [1206]
C99  Cap  value 0.1uF  [1206]
C106  Cap  value 0.1uF  [1206]
C107  Cap Pol1  value 10uF-16V  [1206]
C108  Cap  value 0.1uF  [1206]
C109  Cap Pol1  value 10uF-16V  [1206]
C110  Cap  value 0.1uF  [1206]
C111  Cap  value 0.1uF  [1206]
C112  Cap Pol1  value 22uF-35V  [7343]
C113  Cap Pol1  value 22uF-35V  [7343]
C114  Cap  value 0.1uF  [1206]
C115  Cap  value 0.1uF  [1206]
C116  Cap Pol1  value 10uF-35V  [1206]
C117  Cap Pol1  value 22uF-35V  [7343]
C118  Cap Pol1  value 22uF-35V  [7343]
C119  Cap  value 0.1uF  [1206]
C120  Cap  value 0.1uF  [1206]
C157  Cap Pol1  value 47uF-50v  [电解电容47uf]
C158  Cap  value 0.01uF  [1206]
C159  Cap Pol1  value 22uF-35V  [7343]
C163  Cap Pol1  value 22uF-16V  [7343]
C164  Cap Pol1  value 22uF-35V  [7343]
C165  Cap  value 0.1uF  [1206]
D33  Diode 1N4148  [SOD-80/MLL34]
D34  Diode 1N4007  [SMA]
D35  LL4148  [SMA]
DCDC1  A2415S-1W  [NPSIP7]
DCDC2  A2415S-1W  [NPSIP7]
DCDC3  VRB2405ZP-6WR2  [DIP24]
DCDC4  B2412S_2W  [NPSIP7A_B2412s2]
DCDC5  B0505S_1W  [B0505]
F1  Fuse 1 1A  [1206]
L7  BLM21PG221SN  [2012]
L8  BLM21PG221SN  [2012]
L9  BLM21PG221SN  [2012]
L10  BLM21PG221SN  [2012]
L11  BLM21PG221SN  [2012]
L12  BLM21PG221SN  [2012]
L14  BLM21PG221SN  [2012]
L15  BLM21PG221SN  [2012]
L16  BLM21PG221SN  [2012]
LED1  LED  [0805D]
LED2  LED  [0805D]  (value not drawn)
LED3  LED  [0805D]  (value not drawn)
LED4  LED  [0805D]  (value not drawn)
LED5  LED  [0805D]  (value not drawn)
LED6  LED  [0805D]  (value not drawn)
LED7  LED  [0805D]  (value not drawn)
P16  Header 3  [PHENOX-3]
R123  Res2  value 10K  [1206]
R124  Res2  value 250K  [1206]
R125  Res2  value 240R-1%  [1206]
R126  Res2  value 3.3K-1%  [1206]
R127  Res2  value 3.3K-1%  [1206]
R134  value 25k-1%  [1206]  (hidden comment: Res2)
R135  value 20k-1%  [1206]  (hidden comment: Res2)
R136  value 20k-1%  [1206]  (hidden comment: Res2)
R137  value 4.7k-1%  [1206]  (hidden comment: Res2)
R138  value 20k-1%  [1206]  (hidden comment: Res2)
R139  value 10k-1%  [1206]  (hidden comment: Res2)
R140  value 10k-1%  [1206]  (hidden comment: Res2)
S1  SW-PB  [B3F4050]
U54  TPS70151PWP  [tssop20]
U55  LM317MSTT3  [SOT223-4N]

### Ports
RESET (out)

### Nets
1.8V: C109.1 C110.1 U54.12(VOUT2) U54.13(VOUT2) U54.14(Vsense2/FB2)
3.3V: C107.1 C108.2 LED4.A R124.2 U54.17(Vsense1/FB1) U54.18(VOUT1) U54.19(VOUT1)
+5V_C: C43.2 C95.1 C99.2 C106.2 C111.1 C159.1 C163.1 D33.2(K) DCDC5.2(Vin) L12.2 LED6.A R123.2 U54.2(VIN1) U54.3(VIN1) U54.9(VIN2) U54.10(VIN2)
+5V_COM: C164.1 C165.2 L16.2 LED7.A
+10V: C113.1 C115.2 L14.2
+12V_P: C118.1 C120.2 L15.2 LED5.A
+15V_A: C80.2 C82.1 C112.1 C114.2 D34.2(K) L7.2 LED3.A U55.3(IN)
+15V_C: C88.2 C90.1 L10.2 LED2.A
+24V: C81.1 C83.2 C84.1 C85.2 C89.1 C91.2 C94.1 C98.2 C117.1 C119.2 C157.1 C158.1 DCDC1.1(Vin) DCDC2.1(Vin) DCDC3.22(Vin) DCDC3.23(Vin) DCDC4.1(Vin) F1.2 LED1.A
-15V_A: C86.1 C87.2 L9.2 R136.1
-15V_C: C92.1 C93.2 L11.2 R135.1
DGND: C81.2 C83.1 C84.2 C85.1 C89.2 C91.1 C94.2 C98.1 C117.2 C119.1 C157.2 C158.2 DCDC1.2(GND) DCDC2.2(GND) DCDC3.2(GND) DCDC3.3(GND) DCDC4.2(GND) P16.1 R134.1
GND_A: C80.1 C82.2 C86.2 C87.1 C112.2 C113.2 C114.1 C115.1 C116.2 DCDC1.5(0V) R126.1 R127.1
GND_C: C43.1 C88.1 C90.2 C92.2 C93.1 C95.2 C99.1 C106.1 C107.2 C108.1 C109.2 C110.2 C111.2 C159.2 C163.2 DCDC2.5(0V) DCDC3.16(0V) DCDC5.1(GND) R137.1 R139.1 S1.1 U54.6(~{EN}) U54.7(SEQ) U54.8(GND)
GND_COM: C164.2 C165.1 DCDC5.3(0) R140.1
GND_P: C118.2 C120.1 DCDC4.4(0) R138.1
~{MR2}: U54.5(~{MR2}) U54.16(PG1)
NetC116_1: C116.1 D35.1(A) R125.1 R126.2 R127.2 U55.1(ADJ)
NetD33_1: D33.1(A) R123.1 S1.2 U54.4(~{MR}1)
NetD34_1: D34.1(A) D35.2(K) L14.1 R125.2 U55.2(OUT) U55.4(OUT)
NetDCDC1_4: DCDC1.4(-Vo) L9.1
NetDCDC1_6: DCDC1.6(+Vo) L7.1
NetDCDC2_4: DCDC2.4(-Vo) L11.1
NetDCDC2_6: DCDC2.6(+Vo) L10.1
NetDCDC3_14: DCDC3.14(+Vo) L12.1
NetDCDC4_6: DCDC4.6(+Vo) L15.1
NetDCDC5_4: DCDC5.4(+Vo) L16.1
NetF1_1: F1.1 L8.2
NetL8_1: L8.1 P16.3
NetLED1_K: LED1.K R134.2
NetLED2_K: LED2.K R135.2
NetLED3_K: LED3.K R136.2
NetLED4_K: LED4.K R137.2
NetLED5_K: LED5.K R138.2
NetLED6_K: LED6.K R139.2
NetLED7_K: LED7.K R140.2
NetR124_1: R124.1 U54.15(~{RESET}) ; port RESET

Not connected (* = marked no-connect by the designer): DCDC3 11(NC)*; P16 2; U54 1(NC)* 11(NC)* 20(NC)*

### Notes on the sheet
- Switching Power Supply Input
- 模拟输入输出供电
- (near R134) 外部２４Ａ直流开关电源供电
- 显示板供电
- 电流传感器供电
- ｄｓｐ　３．３Ｖ和１．８Ｖ供电
- 模拟接口供电
- (near R138) 位置传感器供电

### Library data of the parts
C43 C80 C83 C85 C86 C88 C91 C92 C98 C99 C106 C108 C110 C111 C114 C115 C119 C120 C158 C165 = Cap: Capacitor; Published: 8-Jun-2000; LatestRevisionDate: 17-Jul-2002; LatestRevisionNote: Re-released for DXP Platform.; PackageReference: RAD-0.3; Publisher: Altium Limited
C81 C82 C84 C87 C89 C90 C93-C95 C107 C109 C112 C113 C116-C118 C157 C159 C163 C164 = Cap Pol1: Polarized Capacitor (Radial); Published: 8-Jun-2000; LatestRevisionDate: 17-Jul-2002; LatestRevisionNote: Re-released for DXP Platform.; PackageReference: RB7.6-15; Publisher: Altium Limited
D33 = Diode 1N4148: High Conductance Fast Diode; Published: 8-Jun-2000; LatestRevisionDate: 17-Jul-2002; LatestRevisionNote: Re-released for DXP Platform.; DatasheetVersion: 1997; PackageReference: DO-35; Publisher: Altium Limited; Code_JEDEC: DO-204-AH; ComponentLink1Description: Manufacturer Link; ComponentLink1URL: http://www.fairchildsemi.com/; ComponentLink2Description: Datasheet; ComponentLink2URL: http://www.fairchildsemi.com/ds/1N%2F1N4148.pdf
D34 D35 = Diode 1N4007: 1 Amp General Purpose Rectifier; Published: 8-Jun-2000; LatestRevisionDate: 17-Jul-2002; LatestRevisionNote: Re-released for DXP Platform.; DatasheetVersion: 1998; PackageVersion: Aug-1999; PackageReference: DO-41; Publisher: Altium Limited; Code_JEDEC: DO-204-AL; ComponentLink1Description: Manufacturer Link; ComponentLink1URL: http://www.fairchildsemi.com/; ComponentLink2Description: Datasheet; ComponentLink2URL: http://www.fairchildsemi.com/ds/1N%2F1N4001.pdf
DCDC3 = WRB2405ZP-3WR2
DCDC5 = newB0505
F1 = Fuse 1: Fuse; Published: 8-Jun-2000; LatestRevisionDate: 17-Jul-2002; LatestRevisionNote: Re-released for DXP Platform.; PackageReference: PIN-W2/E2.8; Publisher: Altium Limited
L7-L12 L14-L16 = Inductor: Code_IEC: 1005; Value: 10mH; Published: 8-Jun-2000; LatestRevisionDate: 29-May-2009; LatestRevisionNote: IPC-7351 Footprint Added.; PackageReference: 0402-A; Publisher: Altium Limited; PackageDescription: Chip Inductor; Code_JEITA: 0402
P16 = Header 3: Header, 3-Pin; LatestRevisionDate: 17-Jul-2002; LatestRevisionNote: Re-released for DXP Platform.; Publisher: Altium Limited
R123-R127 R134-R140 = Res2: Resistor; Published: 8-Jun-2000; LatestRevisionDate: 17-Jul-2002; LatestRevisionNote: Re-released for DXP Platform.; PackageReference: AXIAL-0.4; Publisher: Altium Limited
S1 = SW-PB: Switch; Published: 24-Mar-1999; LatestRevisionDate: 17-Jul-2002; LatestRevisionNote: Re-released for DXP Platform.; PackageReference: SPST-2; Publisher: Altium Limited
U55 = LM317MSTT3: Three-Terminal Adjustable Output Positive Voltage Regulator; Note: Pin 2 is electrically connected to Pin 4 (TAB); Published: 15-Apr-2002; DatasheetVersion: Nov-1999; PackageVersion: Nov-1999; PackageReference: 318E-04; Publisher: Altium Limited; PackageDescription: SOT-223/SC-73; 4 Leads; Body 6.7 x 7.3 mm, inc. leads (LxW max); ComponentLink1Description: Manufacturer Link; ComponentLink1URL: http://www.onsemi.com/site/products/taxonomy/0,4438,503,00.html; ComponentLink2Description: Datasheet; ComponentLink2URL: http://www.onsemi.com/pub/Collateral/LM317M-D.PDF

## Sheet dsp.SchDoc
size A2
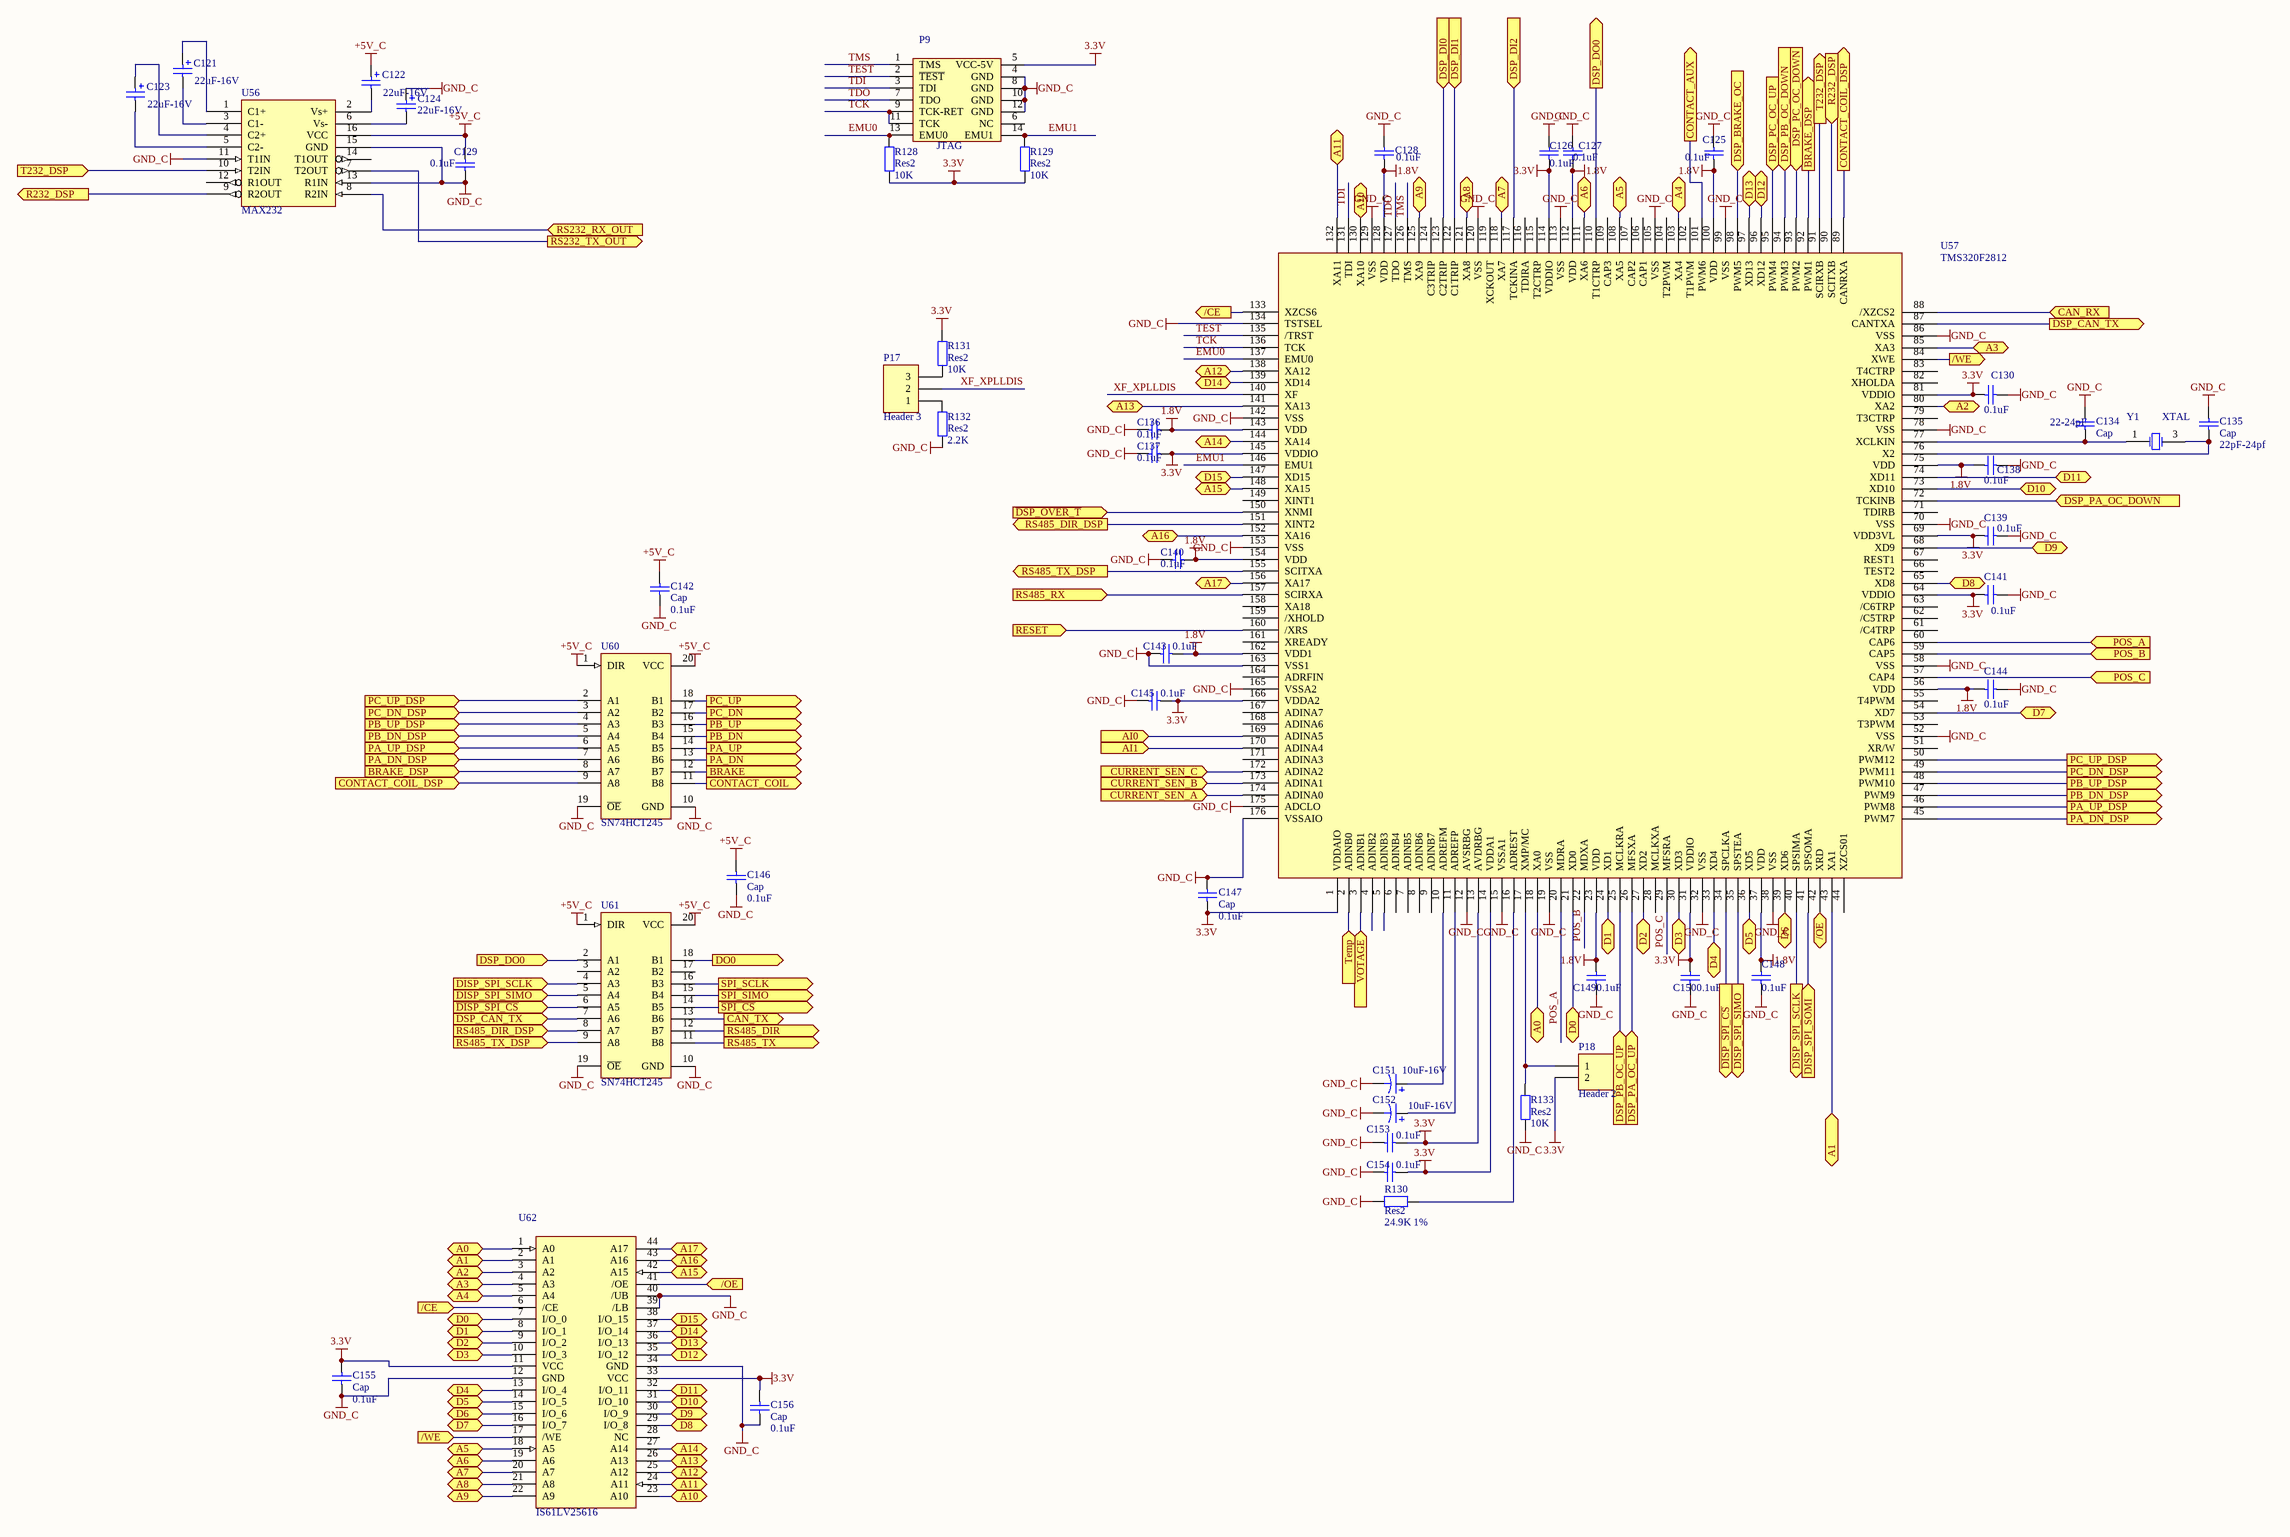
[diagram p5: dsp.SchDoc]

### Parts
C121  value 22uF-16V  [7343]  (hidden comment: 22uF)
C122  value 22uF-16V  [7343]  (hidden comment: 22uF)
C123  value 22uF-16V  [7343]  (hidden comment: 22uF)
C124  value 22uF-16V  [7343]  (hidden comment: 22uF)
C125  value 0.1uF  [1206]  (hidden comment: Cap)
C126  value 0.1uF  [1206]  (hidden comment: Cap)
C127  value 0.1uF  [1206]  (hidden comment: Cap)
C128  value 0.1uF  [1206]  (hidden comment: Cap)
C129  value 0.1uF  [1206]  (hidden comment: Cap)
C130  value 0.1uF  [1206]  (hidden comment: Cap)
C134  Cap  value 22-24pF  [1206]
C135  Cap  value 22pF-24pf  [1206]
C136  value 0.1uF  [1206]  (hidden comment: Cap)
C137  value 0.1uF  [1206]  (hidden comment: Cap)
C138  value 0.1uF  [1206]  (hidden comment: Cap)
C139  value 0.1uF  [1206]  (hidden comment: Cap)
C140  value 0.1uF  [1206]  (hidden comment: Cap)
C141  value 0.1uF  [1206]  (hidden comment: Cap)
C142  Cap  value 0.1uF  [1206]
C143  value 0.1uF  [1206]  (hidden comment: Cap)
C144  value 0.1uF  [1206]  (hidden comment: Cap)
C145  value 0.1uF  [1206]  (hidden comment: Cap)
C146  Cap  value 0.1uF  [1206]
C147  Cap  value 0.1uF  [1206]
C148  value 0.1uF  [1206]  (hidden comment: Cap)
C149  value 0.1uF  [1206]  (hidden comment: Cap)
C150  value 0.1uF  [1206]  (hidden comment: Cap)
C151  value 10uF-16V  [1206]  (hidden comment: Cap Pol1)
C152  value 10uF-16V  [1206]  (hidden comment: Cap Pol1)
C153  value 0.1uF  [1206]  (hidden comment: Cap)
C154  value 0.1uF  [1206]  (hidden comment: Cap)
C155  Cap  value 0.1uF  [1206]
C156  Cap  value 0.1uF  [1206]
P9  JTAG  [DIP14-2.54]
P17  Header 3  [HDR1X3]
P18  Header 2  [HDR1X2]
R128  Res2  value 10K  [1206]
R129  Res2  value 10K  [1206]
R130  Res2  value 24.9K 1%  [1206]
R131  Res2  value 10K  [1206]
R132  Res2  value 2.2K  [1206]
R133  Res2  value 10K  [1206]
U56  MAX232  [SO16_M]
U57  TMS320F2812  [LQFP176_N]
U60  SN74HCT245  [SO20_M]
U61  SN74HCT245  [SO20_M]
U62  IS61LV25616  [TSOP44 - duplicate]
Y1  XTAL  [SMD5032]

### Ports
/CE (in), /CE (out), /OE (in), /OE (out), /WE (in), /WE (out), A0, A1, A2, A3, A4, A5, A6, A7, A8, A9, A10, A11, A12, A13, A14, A15, A16, A17, AI0 (in), AI1 (in), BRAKE (out), BRAKE_DSP (in), BRAKE_DSP (out), CAN_RX (in), CAN_TX (out), CONTACT_AUX (out), CONTACT_COIL (out), CONTACT_COIL_DSP (in), CONTACT_COIL_DSP (out), CURRENT_SEN_A (in), CURRENT_SEN_B (in), CURRENT_SEN_C (in), D0, D1, D2, D3, D4, D5, D6, D7, D8, D9, D10, D11, D12, D13, D14, D15, DISP_SPI_SCLK (in), DISP_SPI_SCLK (out), DISP_SPI_SIMO (in), DISP_SPI_SIMO (out), DISP_SPI_SOMI (in), DO0 (out), DSP_BRAKE_OC (in), DSP_CAN_TX (in), DSP_CAN_TX (out), DSP_DI0 (in), DSP_DI1 (in), DSP_DI2 (in), DSP_DO0 (in), DSP_DO0 (out), DSP_PA_OC_DOWN (in), DSP_PA_OC_UP (in), DSP_PB_OC_DOWN (in), DSP_PB_OC_UP (in), DSP_PC_OC_DOWN (in), DSP_PC_OC_UP (in), PA_DN (out), PA_DN_DSP (in), PA_DN_DSP (out), PA_UP (out), PA_UP_DSP (in), PA_UP_DSP (out), PB_DN (out), PB_DN_DSP (in), PB_DN_DSP (out), PB_UP (out), PB_UP_DSP (in), PB_UP_DSP (out), PC_DN (out), PC_DN_DSP (in), PC_DN_DSP (out), PC_UP (out), PC_UP_DSP (in), PC_UP_DSP (out), POS_A (in), POS_B (in), POS_C (in), R232_DSP (in), R232_DSP (out), RESET (in), RS232_RX_OUT (in), RS232_TX_OUT (out), RS485_DIR (out), RS485_DIR_DSP (in), RS485_DIR_DSP (out), RS485_RX (in), RS485_TX (out), RS485_TX_DSP (in), RS485_TX_DSP (out), SPI_SCLK (out), SPI_SIMO (out), T232_DSP (in), T232_DSP (out), Temp (in), VOTAGE (in), ~{DISP_SPI_CS} (in), ~{DISP_SPI_CS} (out), ~{DSP_OVER_T} (in), ~{SPI_CS} (out)

### Nets
1.8V: C125.1 C127.1 C128.1 C136.1 C138.1 C140.1 C143.2 C144.1 C148.1 C149.1 U57.23(VDD) U57.37(VDD) U57.56(VDD) U57.75(VDD) U57.100(VDD) U57.112(VDD) U57.128(VDD) U57.143(VDD) U57.154(VDD) U57.162(VDD1)
3.3V: C126.1 C130.1 C137.1 C139.1 C141.1 C145.2 C147.2 C150.1 C153.2 C154.2 C155.2 C156.2 P9.5(VCC-5V) P18.2 R128.1 R129.1 R131.2 U57.1(VDDAIO) U57.13(AVDRBG) U57.14(VDDA1) U57.31(VDDIO) U57.64(VDDIO) U57.69(VDD3VL) U57.81(VDDIO) U57.114(VDDIO) U57.145(VDDIO) U57.166(VDDA2) U62.11(VCC) U62.33(VCC)
+5V_C: C122.1 C129.2 C142.2 C146.2 U56.16(VCC) U60.1(DIR) U60.20(VCC) U61.1(DIR) U61.20(VCC)
GND_C: C124.1 C125.2 C126.2 C127.2 C128.2 C129.1 C130.2 C134.2 C135.2 C136.2 C137.2 C138.2 C139.2 C140.2 C141.2 C142.1 C143.1 C144.2 C145.1 C146.1 C147.1 C148.2 C149.2 C150.2 C151.2 C152.2 C153.1 C154.1 C155.1 C156.1 P9.4(GND) P9.8(GND) P9.10(GND) P9.12(GND) R130.1 R132.1 R133.1 U56.11(T1IN) U56.13(R1IN) U56.15(GND) U57.12(AVSRBG) U57.15(VSSA1) U57.19(VSS) U57.32(VSS) U57.38(VSS) U57.52(VSS) U57.58(VSS) U57.70(VSS) U57.78(VSS) U57.86(VSS) U57.99(VSS) U57.105(VSS) U57.113(VSS) U57.120(VSS) U57.129(VSS) U57.134(TSTSEL) U57.142(VSS) U57.153(VSS) U57.163(VSS1) U57.165(VSSA2) U57.175(ADCLO) U57.176(VSSAIO) U60.10(GND) U60.19(~{OE}) U61.10(GND) U61.19(~{OE}) U62.12(GND) U62.34(GND) U62.39(/LB) U62.40(/UB)
AI0: U57.169(ADINA5) ; port AI0
AI1: U57.170(ADINA4) ; port AI1
BRAKE: U60.12(B7) ; port BRAKE
CONTACT_AUX: U57.101(PWM6) ; port CONTACT_AUX
CURRENT_SEN_A: U57.174(ADINA0) ; port CURRENT_SEN_A
CURRENT_SEN_B: U57.173(ADINA1) ; port CURRENT_SEN_B
CURRENT_SEN_C: U57.172(ADINA2) ; port CURRENT_SEN_C
~{DSP_OVER_T}: U57.150(XNMI) ; port ~{DSP_OVER_T}
DO0: U61.18(B1) ; port DO0
EMU0: P9.13(EMU0) R128.2 U57.137(EMU0)
EMU1: P9.14(EMU1) R129.2 U57.146(EMU1)
PA_DN: U60.13(B6) ; port PA_DN
PA_UP: U60.14(B5) ; port PA_UP
PB_DN: U60.15(B4) ; port PB_DN
PB_UP: U60.16(B3) ; port PB_UP
PC_DN: U60.17(B2) ; port PC_DN
PC_UP: U60.18(B1) ; port PC_UP
POS_A: U57.20(MDRA) U57.60(CAP6) ; port POS_A
POS_B: U57.22(MDXA) U57.59(CAP5) ; port POS_B
POS_C: U57.29(MFSRA) U57.57(CAP4) ; port POS_C
RS232_RX_OUT: U56.8(R2IN) ; port RS232_RX_OUT
RS232_TX_OUT: U56.7(T2OUT) ; port RS232_TX_OUT
~{TEST}: P9.2(~{TEST}) U57.135(/TRST)
TCK: P9.9(TCK-RET) P9.11(TCK) U57.136(TCK)
TDI: P9.3(TDI) U57.131(TDI)
TDO: P9.7(TDO) U57.127(TDO)
TMS: P9.1(TMS) U57.126(TMS)
XF_XPLLDIS: P17.2 U57.140(XF)
NetC56_2: U57.117(TCKINA) ; port DSP_DI2
NetC59_2: U57.122(C1TRIP) ; port DSP_DI1
NetC62_2: U57.123(C2TRIP) ; port DSP_DI0
NetC121_1: C121.1 U56.1(C1+)
NetC121_2: C121.2 U56.3(C1-)
NetC122_2: C122.2 U56.2(Vs+)
NetC123_1: C123.1 U56.4(C2+)
NetC123_2: C123.2 U56.5(C2-)
NetC124_2: C124.2 U56.6(Vs-)
NetC134_1: C134.1 U57.77(XCLKIN) Y1.1(OSC1)
NetC135_1: C135.1 U57.76(X2) Y1.3(OSC2)
NetC151_1: C151.1 U57.10(ADREFM)
NetC152_1: C152.1 U57.11(ADREFP)
NetP17_1: P17.1 R132.2
NetP17_3: P17.3 R131.1
NetP18_1: P18.1 R133.2 U57.17(XMP/MC)
NetR78_1: U57.98(PWM5) ; port DSP_BRAKE_OC
NetR81_1: U57.26(MFSXA) ; port DSP_PA_OC_UP
NetR82_1: U57.72(TCKINB) ; port DSP_PA_OC_DOWN
NetR85_1: U57.25(MCLKRA) ; port DSP_PB_OC_UP
NetR86_1: U57.94(PWM3) ; port DSP_PB_OC_DOWN
NetR89_1: U57.95(PWM4) ; port DSP_PC_OC_UP
NetR90_1: U57.93(PWM2) ; port DSP_PC_OC_DOWN
NetR104_1: U57.41(SPSOMA) ; port DISP_SPI_SOMI
NetR106_1: U57.88(/XZCS2) ; port CAN_RX
NetR118_1: U57.157(SCIRXA) ; port RS485_RX
NetR124_1: U57.160(/XRS) ; port RESET
NetR130_2: R130.2 U57.16(ADREST)
NetU38_3: U61.16(B3) ; port SPI_SCLK
NetU41_3: U61.15(B4) ; port SPI_SIMO
NetU42_3: U61.14(B5) ; port ~{SPI_CS}
NetU46_2: U60.11(B8) ; port CONTACT_COIL
NetU48_3: U61.13(B6) ; port CAN_TX
NetU49_3: U61.12(B7) ; port RS485_DIR
NetU52_3: U61.11(B8) ; port RS485_TX
NetU56_9: U56.9(R2OUT) U57.90(SCITXB) ; port R232_DSP
NetU56_10: U56.10(T2IN) U57.91(SCIRXB) ; port T232_DSP
NetU57_2: U57.2(ADINB0) ; port Temp
NetU57_3: U57.3(ADINB1) ; port VOTAGE
NetU57_18: U57.18(XA0) U62.1(A0) ; port A0
NetU57_21: U57.21(XD0) U62.7(I/O_0) ; port D0
NetU57_24: U57.24(XD1) U62.8(I/O_1) ; port D1
NetU57_27: U57.27(XD2) U62.9(I/O_2) ; port D2
NetU57_30: U57.30(XD3) U62.10(I/O_3) ; port D3
NetU57_33: U57.33(XD4) U62.13(I/O_4) ; port D4
NetU57_34: U57.34(SPCLKA) U61.6(A5) ; port ~{DISP_SPI_CS}
NetU57_35: U57.35(SPSTEA) U61.5(A4) ; port DISP_SPI_SIMO
NetU57_36: U57.36(XD5) U62.14(I/O_5) ; port D5
NetU57_39: U57.39(XD6) U62.15(I/O_6) ; port D6
NetU57_40: U57.40(SPSIMA) U61.4(A3) ; port DISP_SPI_SCLK
NetU57_42: U57.42(XRD) U62.41(/OE) ; port /OE
NetU57_43: U57.43(XA1) U62.2(A1) ; port A1
NetU57_45: U57.45(PWM7) U60.7(A6) ; port PA_DN_DSP
NetU57_46: U57.46(PWM8) U60.6(A5) ; port PA_UP_DSP
NetU57_47: U57.47(PWM9) U60.5(A4) ; port PB_DN_DSP
NetU57_48: U57.48(PWM10) U60.4(A3) ; port PB_UP_DSP
NetU57_49: U57.49(PWM11) U60.3(A2) ; port PC_DN_DSP
NetU57_50: U57.50(PWM12) U60.2(A1) ; port PC_UP_DSP
NetU57_54: U57.54(XD7) U62.16(I/O_7) ; port D7
NetU57_65: U57.65(XD8) U62.29(I/O_8) ; port D8
NetU57_68: U57.68(XD9) U62.30(I/O_9) ; port D9
NetU57_73: U57.73(XD10) U62.31(I/O_10) ; port D10
NetU57_74: U57.74(XD11) U62.32(I/O_11) ; port D11
NetU57_80: U57.80(XA2) U62.3(A2) ; port A2
NetU57_84: U57.84(XWE) U62.17(/WE) ; port /WE
NetU57_85: U57.85(XA3) U62.4(A3) ; port A3
NetU57_87: U57.87(CANTXA) U61.7(A6) ; port DSP_CAN_TX
NetU57_89: U57.89(CANRXA) U60.9(A8) ; port CONTACT_COIL_DSP
NetU57_92: U57.92(PWM1) U60.8(A7) ; port BRAKE_DSP
NetU57_96: U57.96(XD12) U62.35(I/O_12) ; port D12
NetU57_97: U57.97(XD13) U62.36(I/O_13) ; port D13
NetU57_103: U57.103(XA4) U62.5(A4) ; port A4
NetU57_108: U57.108(XA5) U62.18(A5) ; port A5
NetU57_110: U57.110(T1CTRP) U61.2(A1) ; port DSP_DO0
NetU57_111: U57.111(XA6) U62.19(A6) ; port A6
NetU57_118: U57.118(XA7) U62.20(A7) ; port A7
NetU57_121: U57.121(XA8) U62.21(A8) ; port A8
NetU57_125: U57.125(XA9) U62.22(A9) ; port A9
NetU57_130: U57.130(XA10) U62.23(A10) ; port A10
NetU57_132: U57.132(XA11) U62.24(A11) ; port A11
NetU57_133: U57.133(XZCS6) U62.6(/CE) ; port /CE
NetU57_138: U57.138(XA12) U62.25(A12) ; port A12
NetU57_139: U57.139(XD14) U62.37(I/O_14) ; port D14
NetU57_141: U57.141(XA13) U62.26(A13) ; port A13
NetU57_144: U57.144(XA14) U62.27(A14) ; port A14
NetU57_147: U57.147(XD15) U62.38(I/O_15) ; port D15
NetU57_148: U57.148(XA15) U62.42(A15) ; port A15
NetU57_151: U57.151(XINT2) U61.8(A7) ; port RS485_DIR_DSP
NetU57_152: U57.152(XA16) U62.43(A16) ; port A16
NetU57_155: U57.155(SCITXA) U61.9(A8) ; port RS485_TX_DSP
NetU57_156: U57.156(XA17) U62.44(A17) ; port A17

Not connected (* = marked no-connect by the designer): P9 6(NC); U56 12(R1OUT) 14(T1OUT); U57 4(ADINB2) 5(ADINB3) 6(ADINB4) 7(ADINB5) 8(ADINB6) 9(ADINB7) 28(MCLKXA) 44(XZCS01) 51(XR/W) 53(T3PWM) 55(T4PWM) 61(/C4TRP) 62(/C5TRP) 63(/C6TRP) 66(TEST2) 67(REST1) 71(TDIRB) 79(T3CTRP) 82(XHOLDA) 83(T4CTRP) 102(T1PWM) 104(T2PWM) 106(CAP1) 107(CAP2) 109(CAP3) 115(T2CTRP) 116(TDIRA) 119(XCKOUT) 124(C3TRIP) 149(XINT1) 158(XA18) 159(/XHOLD) 161(XREADY) 164(ADRFIN) 167(ADINA7) 168(ADINA6) 171(ADINA3); U61 3(A2) 17(B2); U62 28(NC)

### Library data of the parts
C121-C124 = Cap Pol2: Polarized Capacitor (Axial); Published: 8-Jun-2000; LatestRevisionDate: 17-Jul-2002; LatestRevisionNote: Re-released for DXP Platform.; PackageReference: POLAR0.8; Publisher: Altium Limited
C125-C130 C134-C150 C153-C156 = Cap: Capacitor; Published: 8-Jun-2000; LatestRevisionDate: 17-Jul-2002; LatestRevisionNote: Re-released for DXP Platform.; PackageReference: RAD-0.3; Publisher: Altium Limited
C151 C152 = Cap Pol1: Polarized Capacitor (Radial); Published: 8-Jun-2000; LatestRevisionDate: 17-Jul-2002; LatestRevisionNote: Re-released for DXP Platform.; PackageReference: RB7.6-15; Publisher: Altium Limited
P17 = Header 3: Header, 3-Pin; LatestRevisionDate: 17-Jul-2002; LatestRevisionNote: Re-released for DXP Platform.; Publisher: Altium Limited
P18 = Header 2: Header, 2-Pin; LatestRevisionDate: 17-Jul-2002; LatestRevisionNote: Re-released for DXP Platform.; Publisher: Altium Limited
R128-R133 = Res2: Resistor; Published: 8-Jun-2000; LatestRevisionDate: 17-Jul-2002; LatestRevisionNote: Re-released for DXP Platform.; PackageReference: AXIAL-0.4; Publisher: Altium Limited
U56 = MAX232: DUAL EIA-232 DRIVER/RECEIVER
Y1 = XTAL: Crystal Oscillator; Published: 8-Jun-2000; LatestRevisionDate: 17-Jul-2002; LatestRevisionNote: Re-released for DXP Platform.; PackageReference: R38; Publisher: Altium Limited